# EAGLE design 7880_IO (EAGLE 7.2.0)
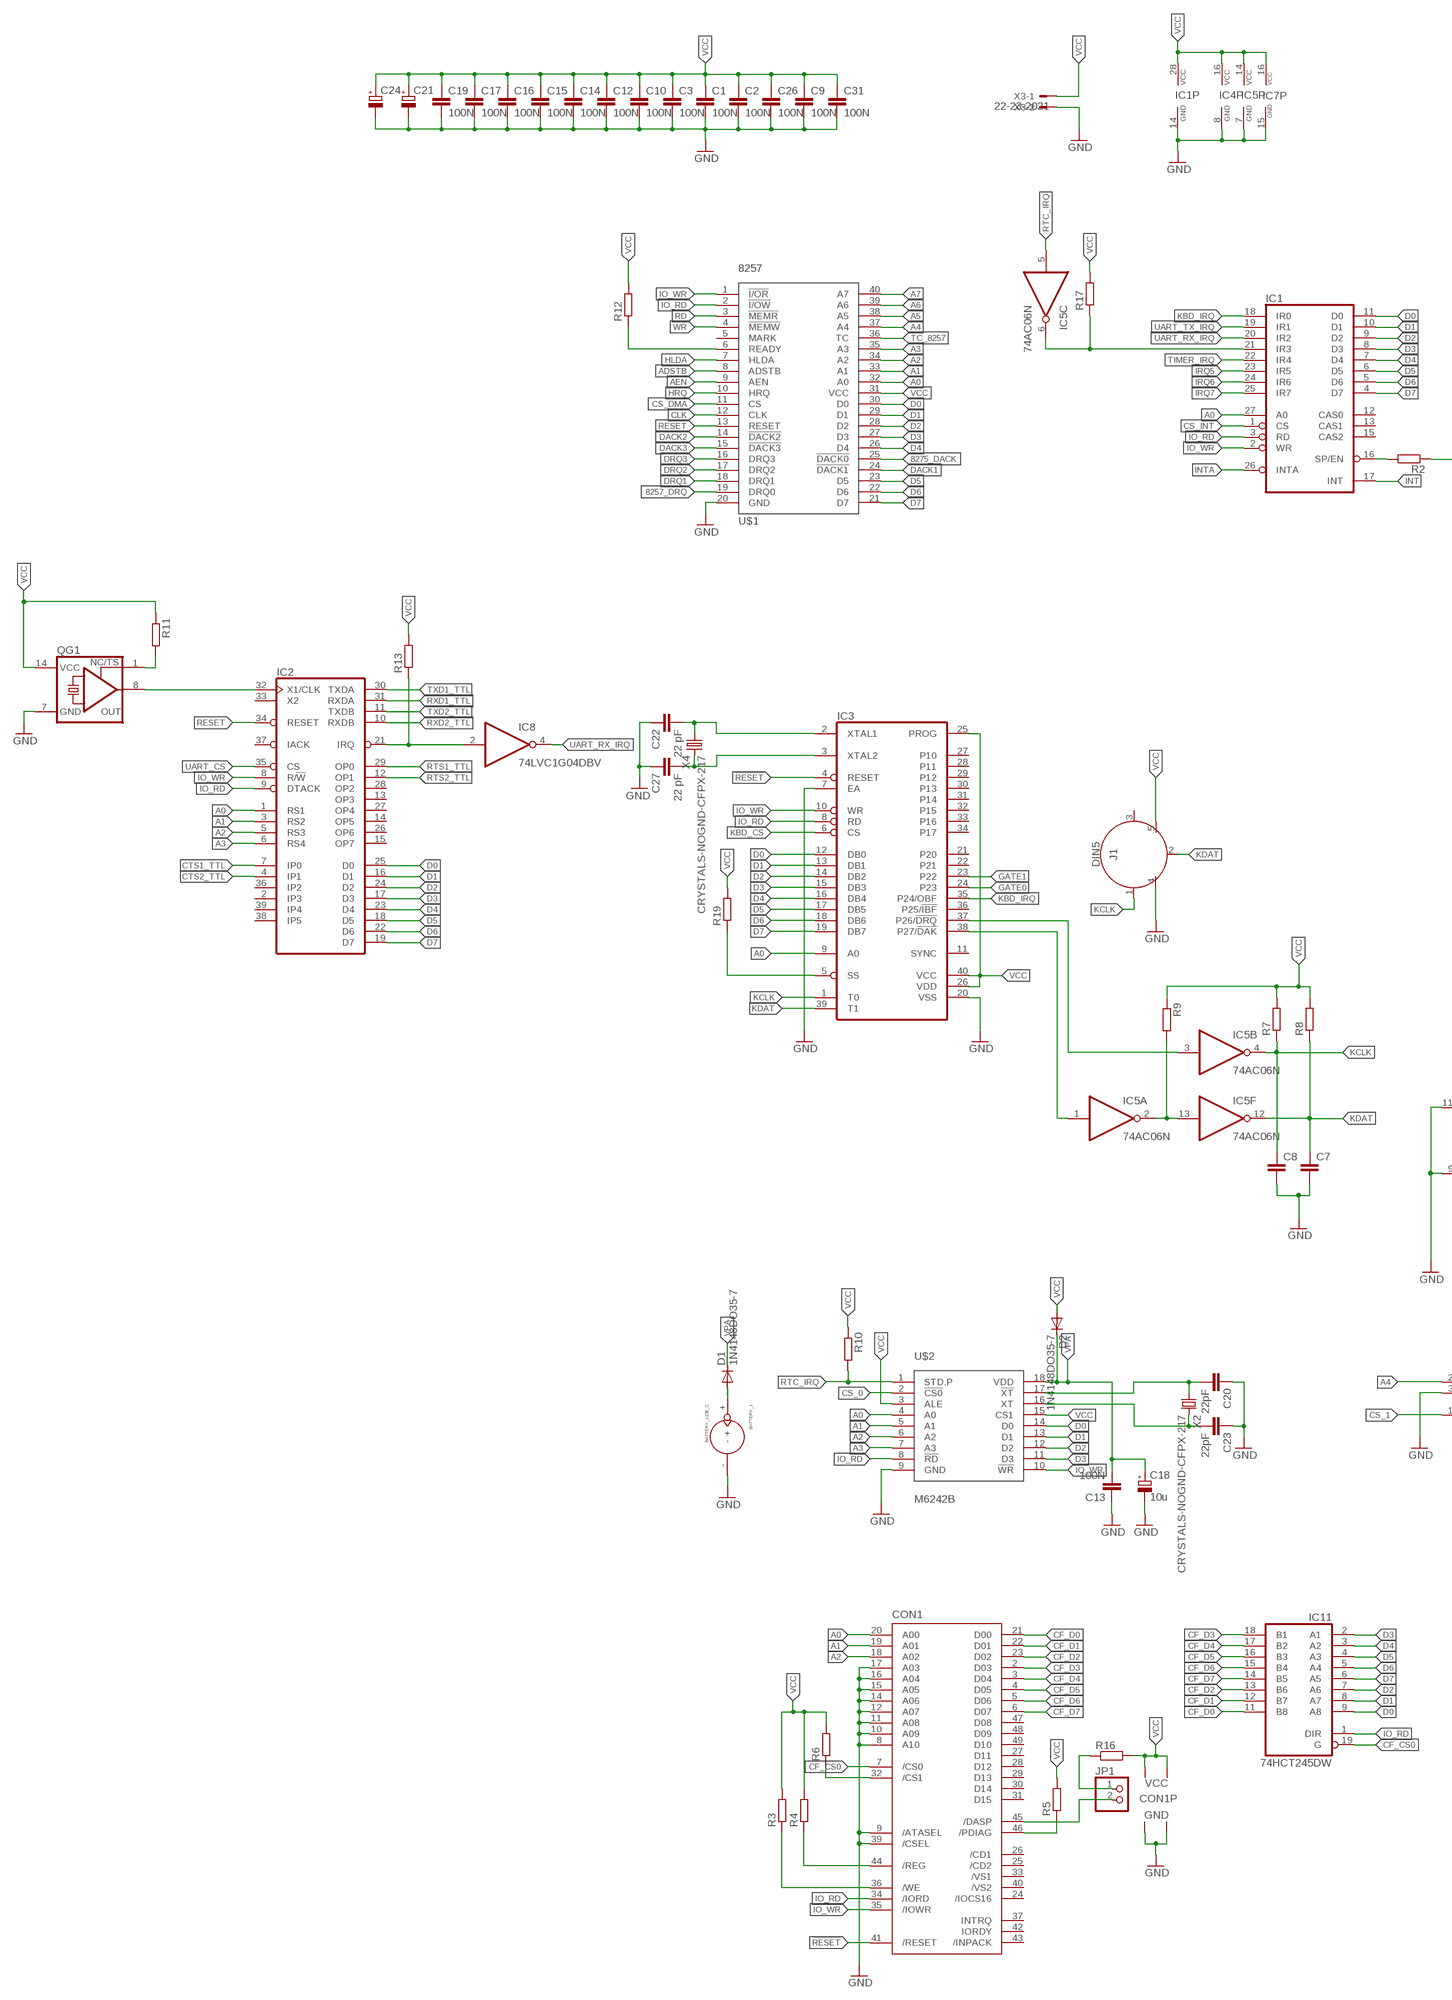
[diagram p0: schematic, sheet 1, part 1 of 2]
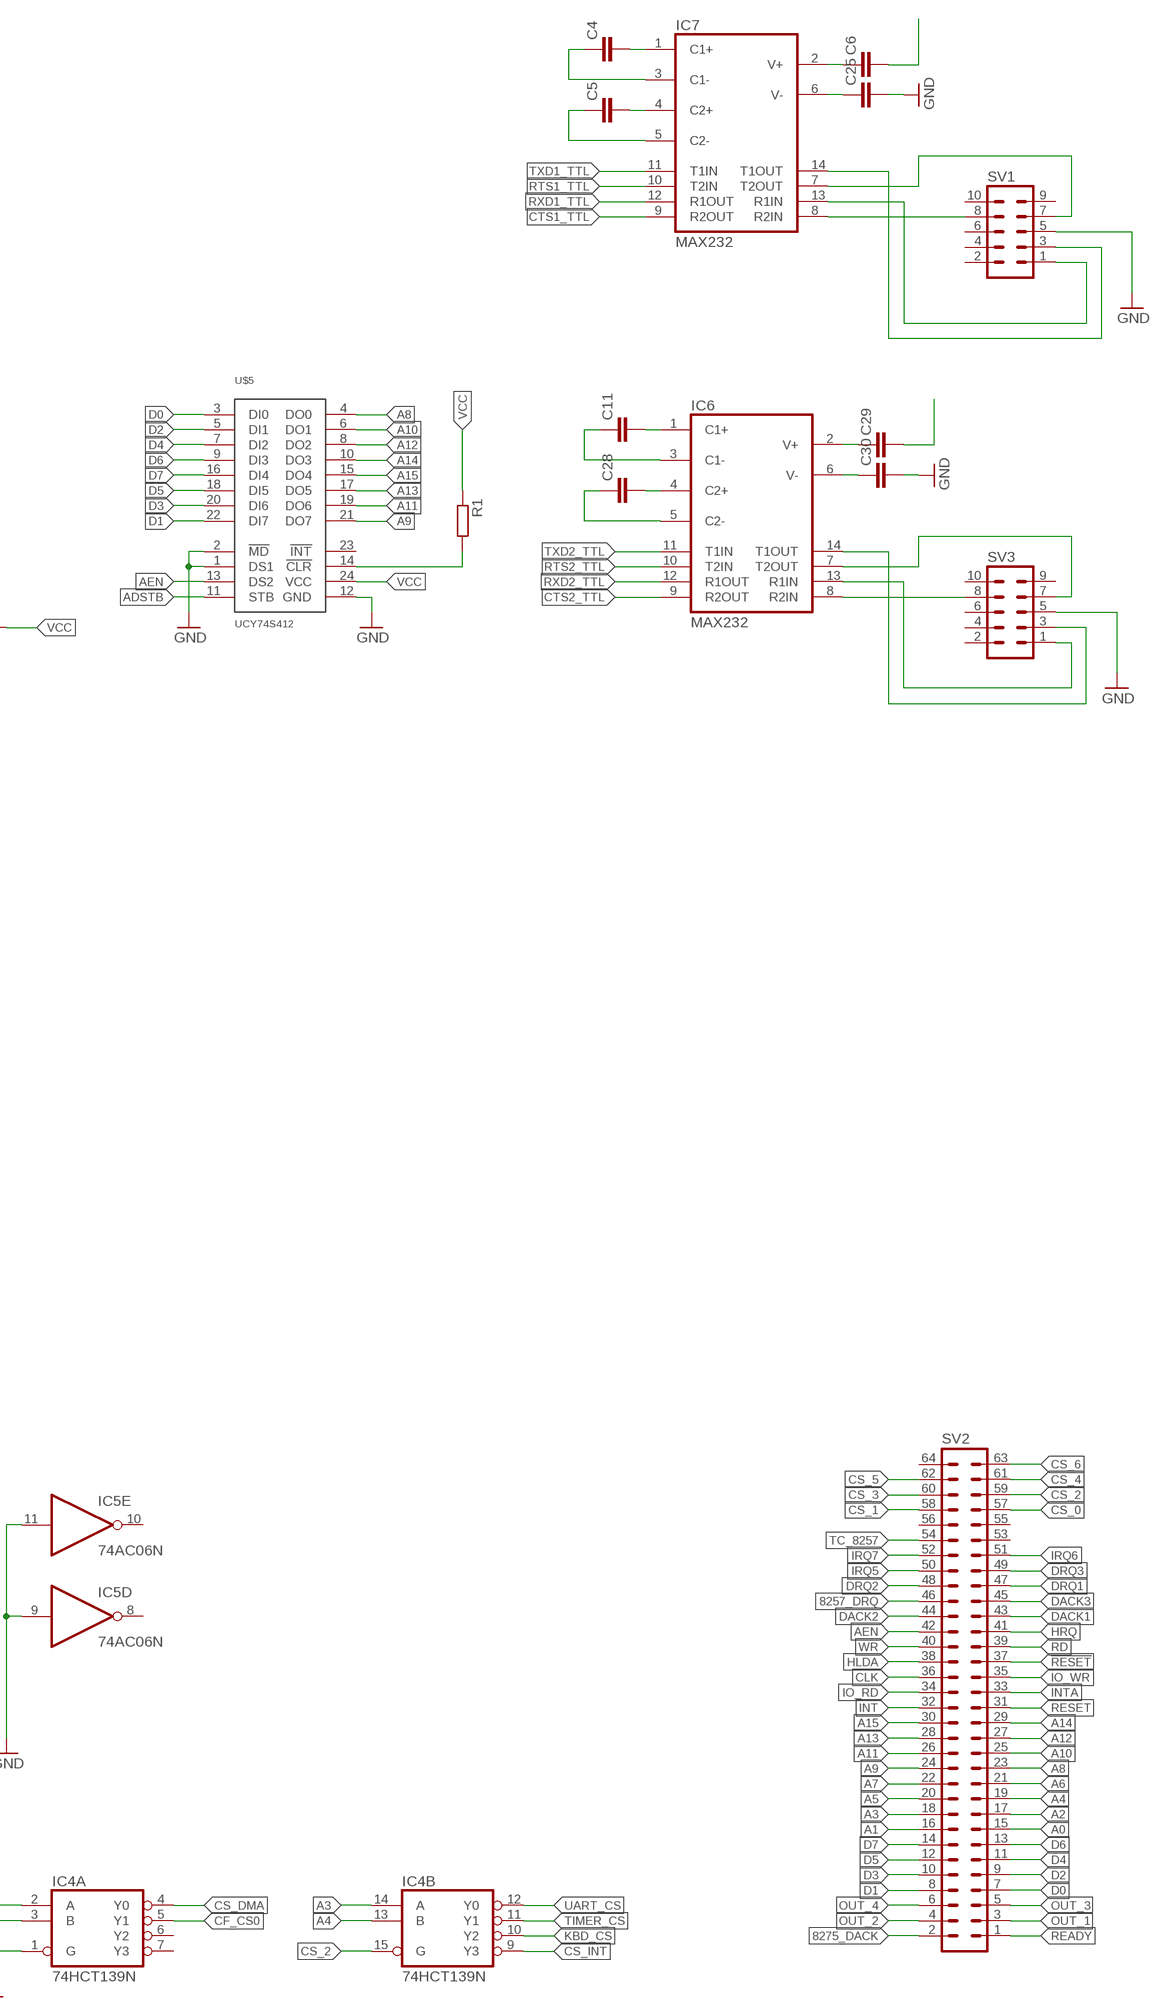
[diagram p1: schematic, sheet 1, part 2 of 2]

## Parts
BATTERY_1  BATTERY_1236_C  [BATTERY_1236_C]
C1  100N  C-EUC0603  [C0603]
C2  100N  C-EUC0603  [C0603]
C3  100N  C-EUC0603  [C0603]
C4  C-EUC0603  [C0603]
C5  C-EUC0603  [C0603]
C6  C-EUC0603  [C0603]
C7  C-EUC0603  [C0603]
C8  C-EUC0603  [C0603]
C9  100N  C-EUC0603  [C0603]
C10  100N  C-EUC0603  [C0603]
C11  C-EUC0603  [C0603]
C12  100N  C-EUC0603  [C0603]
C13  100N  C-EUC0603  [C0603]
C14  100N  C-EUC0603  [C0603]
C15  100N  C-EUC0603  [C0603]
C16  100N  C-EUC0603  [C0603]
C17  100N  C-EUC0603  [C0603]
C18  10u  CPOL-EUSMCB  [SMC_B]
C19  100N  C-EUC0603  [C0603]
C20  22pF  C-EUC0603  [C0603]
C21  CPOL-EUE3.5-8  [E3,5-8]
C22  22 pF  C-EUC0603  [C0603]
C23  22pF  C-EUC0603  [C0603]
C24  CPOL-EUSMCB  [SMC_B]
C25  C-EUC0603  [C0603]
C26  100N  C-EUC0603  [C0603]
C27  22 pF  C-EUC0603  [C0603]
C28  C-EUC0603  [C0603]
C29  C-EUC0603  [C0603]
C30  C-EUC0603  [C0603]
C31  100N  C-EUC0603  [C0603]
CON1  CF-CARD-IDE_MODE  [MI20-50PD-SF]
D1  1N4148DO35-7  [DO35-7]
D2  1N4148DO35-7  [DO35-7]
IC1  8259A  [DIL28-6]
IC2  MC68681P  [DIL40]
IC3  UPI-8042AH  [DIL40]
IC4  74HCT139N  [DIL16]
IC5  74AC06N  [DIL14]
IC6  MAX232  [DIL16]
IC7  MAX232  [DIL16]
IC8  74LVC1G04DBV  [SOT23-5]
IC11  74HCT245DW  [SO20W]
J1  DIN5  [DIN5-RA-PTH]
JP1  PINHD-1X2  [1X02]
QG1  XO-14  [DIL14S]
R1  R-EU_R0603  [R0603]
R2  R-EU_R0603  [R0603]
R3  R-EU_R0603  [R0603]
R4  R-EU_0204/7  [0204/7]
R5  R-EU_0207/10  [0207/10]
R6  R-EU_R0603  [R0603]
R7  R-EU_0204/5  [0204/5]
R8  R-EU_M0805  [M0805]
R9  R-EU_R0603  [R0603]
R10  R-EU_R0603  [R0603]
R11  R-EU_R0603  [R0603]
R12  R-EU_R0603  [R0603]
R13  R-EU_0204/7  [0204/7]
R16  R-EU_R0603  [R0603]
R17  R-EU_0204/7  [0204/7]
R19  R-EU_0204/5  [0204/5]
SV1  ML10  [ML10]
SV2  ML64L  [ML64L]
SV3  ML10  [ML10]
U$1  8257  [DIL40]
U$2  M6242B  [DIL18]
U$5  UCY74S412  [DIL24-6]
X2  CRYSTALS-NOGND-CFPX-217  [3.2X1.5-2-PAD]
X3  22-23-2021  [22-23-2021]
X4  CRYSTALS-NOGND-CFPX-217  [3.2X1.5-2-PAD]

## Nets
8257_DRQ: SV2.46 U$1.19(DRQ0)
8275_DACK: SV2.2 U$1.25(!DACK0)
2457600HZ: IC2.32(X1/CLK) QG1.8(OUT)
!RESET: CON1.41(/RESET) IC3.4(RESET) SV2.37
A0: CON1.20(A00) IC1.27(A0) IC2.1(RS1) IC3.9(A0) SV2.15 U$1.32(A0) U$2.4(A0)
A1: CON1.19(A01) IC2.3(RS2) SV2.16 U$1.33(A1) U$2.5(A1)
A2: CON1.18(A02) IC2.5(RS3) SV2.17 U$1.34(A2) U$2.6(A2)
A3: IC2.6(RS4) IC4.14(B:A) SV2.18 U$1.35(A3) U$2.7(A3)
A4: IC4.2(A:A) IC4.13(B:B) SV2.19 U$1.37(A4)
A5: SV2.20 U$1.38(A5)
A6: SV2.21 U$1.39(A6)
A7: SV2.22 U$1.40(A7)
A8: SV2.23 U$5.4(DO0)
A9: SV2.24 U$5.21(DO7)
A10: SV2.25 U$5.6(DO1)
A11: SV2.26 U$5.19(DO6)
A12: SV2.27 U$5.8(DO2)
A13: SV2.28 U$5.17(DO5)
A14: SV2.29 U$5.10(DO3)
A15: SV2.30 U$5.15(DO4)
ADSTB: U$1.8(ADSTB) U$5.11(STB)
AEN: SV2.42 U$1.9(AEN) U$5.13(DS2)
CF_CS0: CON1.7(/CS0) IC4.5(A:Y1) IC11.19(G)
CF_D0: CON1.21(D00) IC11.11(B8)
CF_D1: CON1.22(D01) IC11.12(B7)
CF_D2: CON1.23(D02) IC11.13(B6)
CF_D3: CON1.2(D03) IC11.18(B1)
CF_D4: CON1.3(D04) IC11.17(B2)
CF_D5: CON1.4(D05) IC11.16(B3)
CF_D6: CON1.5(D06) IC11.15(B4)
CF_D7: CON1.6(D07) IC11.14(B5)
CLK: SV2.36 U$1.12(CLK)
COM1_CTS: IC7.8(R2IN) SV1.8
COM1_RXD: IC7.13(R1IN) SV1.1
COM1_TXD: IC7.14(T1OUT) SV1.3
CS_0: SV2.57 U$2.2(!CS0)
CS_1: IC4.1(A:G) SV2.58
CS_2: IC4.15(B:G) SV2.59
CS_3: SV2.60
CS_4: SV2.61
CS_5: SV2.62
CS_6: SV2.63
CS_DMA: IC4.4(A:Y0) U$1.11(CS)
CS_INT: IC1.1(CS) IC4.9(B:Y3)
CTS1_TTL: IC2.7(IP0) IC7.9(R2OUT)
CTS2_TTL: IC2.4(IP1) IC6.9(R2OUT)
D0: IC1.11(D0) IC2.25(D0) IC3.12(DB0) IC11.9(A8) SV2.7 U$1.30(D0) U$2.14(D0) U$5.3(DI0)
D1: IC1.10(D1) IC2.16(D1) IC3.13(DB1) IC11.8(A7) SV2.8 U$1.29(D1) U$2.13(D1) U$5.22(DI7)
D2: IC1.9(D2) IC2.24(D2) IC3.14(DB2) IC11.7(A6) SV2.9 U$1.28(D2) U$2.12(D2) U$5.5(DI1)
D3: IC1.8(D3) IC2.17(D3) IC3.15(DB3) IC11.2(A1) SV2.10 U$1.27(D3) U$2.11(D3) U$5.20(DI6)
D4: IC1.7(D4) IC2.23(D4) IC3.16(DB4) IC11.3(A2) SV2.11 U$1.26(D4) U$5.7(DI2)
D5: IC1.6(D5) IC2.18(D5) IC3.17(DB5) IC11.4(A3) SV2.12 U$1.23(D5) U$5.18(DI5)
D6: IC1.5(D6) IC2.22(D6) IC3.18(DB6) IC11.5(A4) SV2.13 U$1.22(D6) U$5.9(DI3)
D7: IC1.4(D7) IC2.19(D7) IC3.19(DB7) IC11.6(A5) SV2.14 U$1.21(D7) U$5.16(DI4)
DACK1: SV2.43 U$1.24(!DACK1)
DACK2: SV2.44 U$1.14(!DACK2)
DACK3: SV2.45 U$1.15(!DACK3)
DRQ1: SV2.47 U$1.18(DRQ1)
DRQ2: SV2.48 U$1.17(DRQ2)
DRQ3: SV2.49 U$1.16(DRQ3)
GATE0: IC3.24(P23)
GATE1: IC3.23(P22)
GND: BATTERY_1.- C1.2 C2.2 C3.2 C7.2 C8.2 C9.2 C10.2 C12.2 C13.1 C14.2 C15.2 C16.2 C17.2 C18.- C19.2 C20.1 C21.- C22.1 C23.1 C24.- C25.2 C26.2 C27.1 C30.2 C31.2 CON1.1(GND1) CON1.8(A10) CON1.9(/ATASEL) CON1.10(A09) CON1.11(A08) CON1.12(A07) CON1.14(A06) CON1.15(A05) CON1.16(A04) CON1.17(A03) CON1.39(/CSEL) CON1.50(GND2) IC1.14(GND) IC3.7(EA) IC3.20(VSS) IC4.3(A:B) IC4.8(P:GND) IC5.7(P:GND) IC5.9(D:I) IC5.11(E:I) IC7.15(GND) J1.4 QG1.7(GND) SV1.5 SV3.5 U$1.20(GND) U$2.9(GND) U$5.1(DS1) U$5.2(!MD) U$5.12(GND) X3.2
HLDA: SV2.38 U$1.7(HLDA)
HRQ: SV2.41 U$1.10(HRQ)
INT: IC1.17(INT) SV2.32
INTA: IC1.26(INTA) SV2.33
IO_RD: CON1.34(/IORD) IC1.3(RD) IC2.9(DTACK) IC3.8(RD) IC11.1(DIR) SV2.34 U$1.2(!I/OW) U$2.8(!RD)
IO_WR: CON1.35(/IOWR) IC1.2(WR) IC2.8(R/!W) IC3.10(WR) SV2.35 U$1.1(!I/OR) U$2.10(!WR)
IRQ5: IC1.23(IR5) SV2.50
IRQ6: IC1.24(IR6) SV2.51
IRQ7: IC1.25(IR7) SV2.52
KBD_CS: IC3.6(CS) IC4.10(B:Y2)
KBD_IRQ: IC1.18(IR0) IC3.35(P24/OBF)
KCLK: C8.1 IC3.1(T0) IC5.4(B:O) J1.1 R7.1
KDAT: C7.1 IC3.39(T1) IC5.12(F:O) J1.2 R8.1
N$1: R1.2 U$5.14(!CLR)
N$2: IC1.16(SP/EN) R2.2
N$3: IC3.38(P27/!DAK) IC5.1(A:I)
N$4: CON1.36(/WE) R3.1
N$5: R12.1 U$1.6(READY)
N$6: QG1.1(TS) R11.2
N$8: IC2.21(IRQ) IC8.2(I) R13.1
N$9: C4.2 IC7.1(C1+)
N$10: C5.2 IC7.4(C2+)
N$11: C5.1 IC7.5(C2-)
N$12: C4.1 IC7.3(C1-)
N$13: C6.1 IC7.2(V+)
N$14: C25.1 IC7.6(V-)
N$15: IC6.7(T2OUT) SV3.7
N$16: C11.2 IC6.1(C1+)
N$17: IC3.37(P26/!DRQ) IC5.3(B:I)
N$18: IC7.7(T2OUT) SV1.7
N$19: CON1.44(/REG) R4.1
N$20: IC5.2(A:O) IC5.13(F:I) R9.2
N$21: CON1.46(/PDIAG) R5.1
N$22: BATTERY_1.+ D1.A
N$26: C28.2 IC6.4(C2+)
N$27: C28.1 IC6.5(C2-)
N$29: CON1.32(/CS1) R6.1
N$30: C11.1 IC6.3(C1-)
N$31: C29.1 IC6.2(V+)
N$32: IC1.21(IR3) IC5.6(C:O) R17.1
N$33: CON1.45(/DASP) JP1.2
N$34: JP1.1 R16.1
N$35: IC3.5(SS) R19.1
N$36: IC6.13(R1IN) SV3.1
N$38: IC6.14(T1OUT) SV3.3
N$39: IC6.8(R2IN) SV3.8
N$40: C30.1 IC6.6(V-)
OUT_1: SV2.3
OUT_2: SV2.4
OUT_3: SV2.5
OUT_4: SV2.6
RD: SV2.39 U$1.3(!MEMR)
READY: SV2.1
RESET: IC2.34(RESET) SV2.31 U$1.13(RESET)
RTC_IRQ: IC5.5(C:I) R10.2 U$2.1(STD.P)
RTS1_TTL: IC2.29(OP0) IC7.10(T2IN)
RTS2_TTL: IC2.12(OP1) IC6.10(T2IN)
RXD1_TTL: IC2.31(RXDA) IC7.12(R1OUT)
RXD2_TTL: IC2.10(RXDB) IC6.12(R1OUT)
SOSCI: C20.2 U$2.17(!XT) X2.1
SOSCO: C23.2 U$2.16(XT) X2.2
TC_8257: SV2.54 U$1.36(TC)
TIMER_CS: IC4.11(B:Y1)
TIMER_IRQ: IC1.22(IR4)
TXD1_TTL: IC2.30(TXDA) IC7.11(T1IN)
TXD2_TTL: IC2.11(TXDB) IC6.11(T1IN)
UART_CS: IC2.35(CS) IC4.12(B:Y0)
UART_RX_IRQ: IC1.20(IR2) IC8.4(O)
UART_TX_IRQ: IC1.19(IR1)
VCC: C1.1 C2.1 C3.1 C6.2 C9.1 C10.1 C12.1 C14.1 C15.1 C16.1 C17.1 C19.1 C21.+ C24.+ C26.1 C29.2 C31.1 CON1.13(VCC2) CON1.38(VCC1) D2.A IC1.28(VCC) IC3.25(PROG) IC3.26(VDD) IC3.40(VCC) IC4.16(P:VCC) IC5.14(P:VCC) IC7.16(VCC) J1.5 QG1.14(VCC) R1.1 R2.1 R3.2 R4.2 R5.2 R6.2 R7.2 R8.2 R9.1 R10.1 R11.1 R12.2 R13.2 R16.2 R17.2 R19.2 U$1.31(VCC) U$2.3(ALE) U$2.15(CS1) U$5.24(VCC) X3.1
VPA: C13.2 C18.+ D1.C D2.C U$2.18(VDD)
WR: SV2.40 U$1.4(!MEMW)
XTAL1: C22.2 IC3.2(XTAL1) X4.1
XTAL2: C27.2 IC3.3(XTAL2) X4.2
Unconnected: CON1.24(/IOCS16) CON1.25(/CD2) CON1.26(/CD1) CON1.27(D11) CON1.28(D12) CON1.29(D13) CON1.30(D14) CON1.31(D15) CON1.33(/VS1) CON1.37(INTRQ) CON1.40(/VS2) CON1.42(IORDY) CON1.43(/INPACK) CON1.47(D08) CON1.48(D09) CON1.49(D10) IC1.12(CAS0) IC1.13(CAS1) IC1.15(CAS2) IC2.2(IP3) IC2.13(OP3) IC2.14(OP5) IC2.15(OP7) IC2.26(OP6) IC2.27(OP4) IC2.28(OP2) IC2.33(X2) IC2.36(IP2) IC2.37(IACK) IC2.38(IP5) IC2.39(IP4) IC3.11(SYNC) IC3.21(P20) IC3.22(P21) IC3.27(P10) IC3.28(P11) IC3.29(P12) IC3.30(P13) IC3.31(P14) IC3.32(P15) IC3.33(P16) IC3.34(P17) IC3.36(P25/!IBF) IC4.6(A:Y2) IC4.7(A:Y3) IC5.8(D:O) IC5.10(E:O) J1.3 SV1.2 SV1.4 SV1.6 SV1.9 SV1.10 SV2.53 SV2.55 SV2.56 SV2.64 SV3.2 SV3.4 SV3.6 SV3.9 SV3.10 U$1.5(MARK) U$5.23(!INT)

## Power pins joined to a net without a drawn wire
GND: IC2.20(GND) IC6.15(GND) IC8.3(GND) IC11.10(GND)
VCC: IC2.40(VCC) IC6.16(VCC) IC8.5(VCC) IC11.20(VCC)

## Library data of the parts
BATTERY_1 = Itead_BP_110825.lbr:BATTERY_1236_C: SOC004
C1-C17 C19 C20 C22 C23 C25-C31 = rcl:C-EU: CAPACITOR, European symbol
C18 C21 C24 = rcl:CPOL-EU: POLARIZED CAPACITOR, European symbol
CON1 = con-hirose:CF-CARD-IDE_MODE: Compact Flash Adapter Type I or II without Eject Button Source: con-hirose.lbr from Bob Starr <rtzaudio@mindspring.com>; OC_FARNELL: unknown; OC_NEWARK: unknown
D1 D2 = diode:1N4148: DIODE high speed (Philips)
IC1 = micro-intel:8259A: MICROCOMPUTER/PERIPHERAL DEVICE; OC_FARNELL: unknown; OC_NEWARK: unknown
IC2 = micro-mc68000:MC68681P: 68xxx PROCESSOR; OC_FARNELL: unknown; OC_NEWARK: unknown
IC3 = micro-intel:UPI-8042AH: MICROCOMPUTER/PERIPHERAL DEVICE; OC_FARNELL: unknown; OC_NEWARK: unknown
IC4 = 74xx-eu:74*139: Dual 2-line to 4-line DECODER/DEMULTIPLEXER
IC5 = 74xx-eu:74*06: Hex INVERTER, open collector high-voltage output
IC6 IC7 = maxim:MAX232: RS232 TRANSCEIVER; MF: MAXIM; MPN: MAX232ACPE+; OC_FARNELL: 9723773; OC_NEWARK: 68K4544
IC8 = 74xx-little-us:74*1G04: INVERTER Gate
IC11 = 74xx-eu:74*245: Octal BUS TRANSCEIVER, 3-state
J1 = SparkFun-Connectors:DIN5: DIN5 Connector - Female Right Angle (frequently used as a MIDI Jack connector) This type of connector and cable is frequently used for transmitting midi data (musical instrument digital interface). It is what you usually see on a keyboard or set of electronic drums. Learn more here <https://en.wikipedia.org/wiki/MIDI>. For more information on the pinout and electrical specifications of MIDI communications, please see the following resource: https://www.midi.org/specifications/item/midi-din-electrical-specification Here is the connector we sell at SparkFun: MIDI Connector - Female Right Angle <https://www.sparkfun.com/products/9536> (PRT-09536) Datasheet <hhttp://www.sparkfun.com/datasheets/Prototyping/Connectors/MIDI-RA.pdf> It is used on this SparkFun product: SparkFun MIDI Shield <https://www.sparkfun.com/products/12898> (DEV-12898); PROD_ID: CONN-09481
JP1 = pinhead:PINHD-1X2: PIN HEADER
QG1 = crystal:XO-: CRYSTAL; OC_FARNELL: unknown; OC_NEWARK: unknown
R1-R13 R16 R17 R19 = rcl:R-EU_: RESISTOR, European symbol
SV1 SV3 = con-ml:ML10: HARTING; OC_FARNELL: unknown; OC_NEWARK: unknown
SV2 = con-harting-ml:ML64: HARTING; OC_FARNELL: unknown; OC_NEWARK: unknown
U$1 = mw:8257
U$2 = mw:M6242B
U$5 = mw:UCY74S412
X2 X4 = IQD-Frequency-Products:CRYSTALS-NOGND: CRYSTALS CAN NOT GROUNDED
X3 = con-molex:22-23-2021: .100" (2.54mm) Center Header - 2 Pin; MF: MOLEX; MPN: 22-23-2021; OC_FARNELL: 1462926; OC_NEWARK: 25C3832

## Board
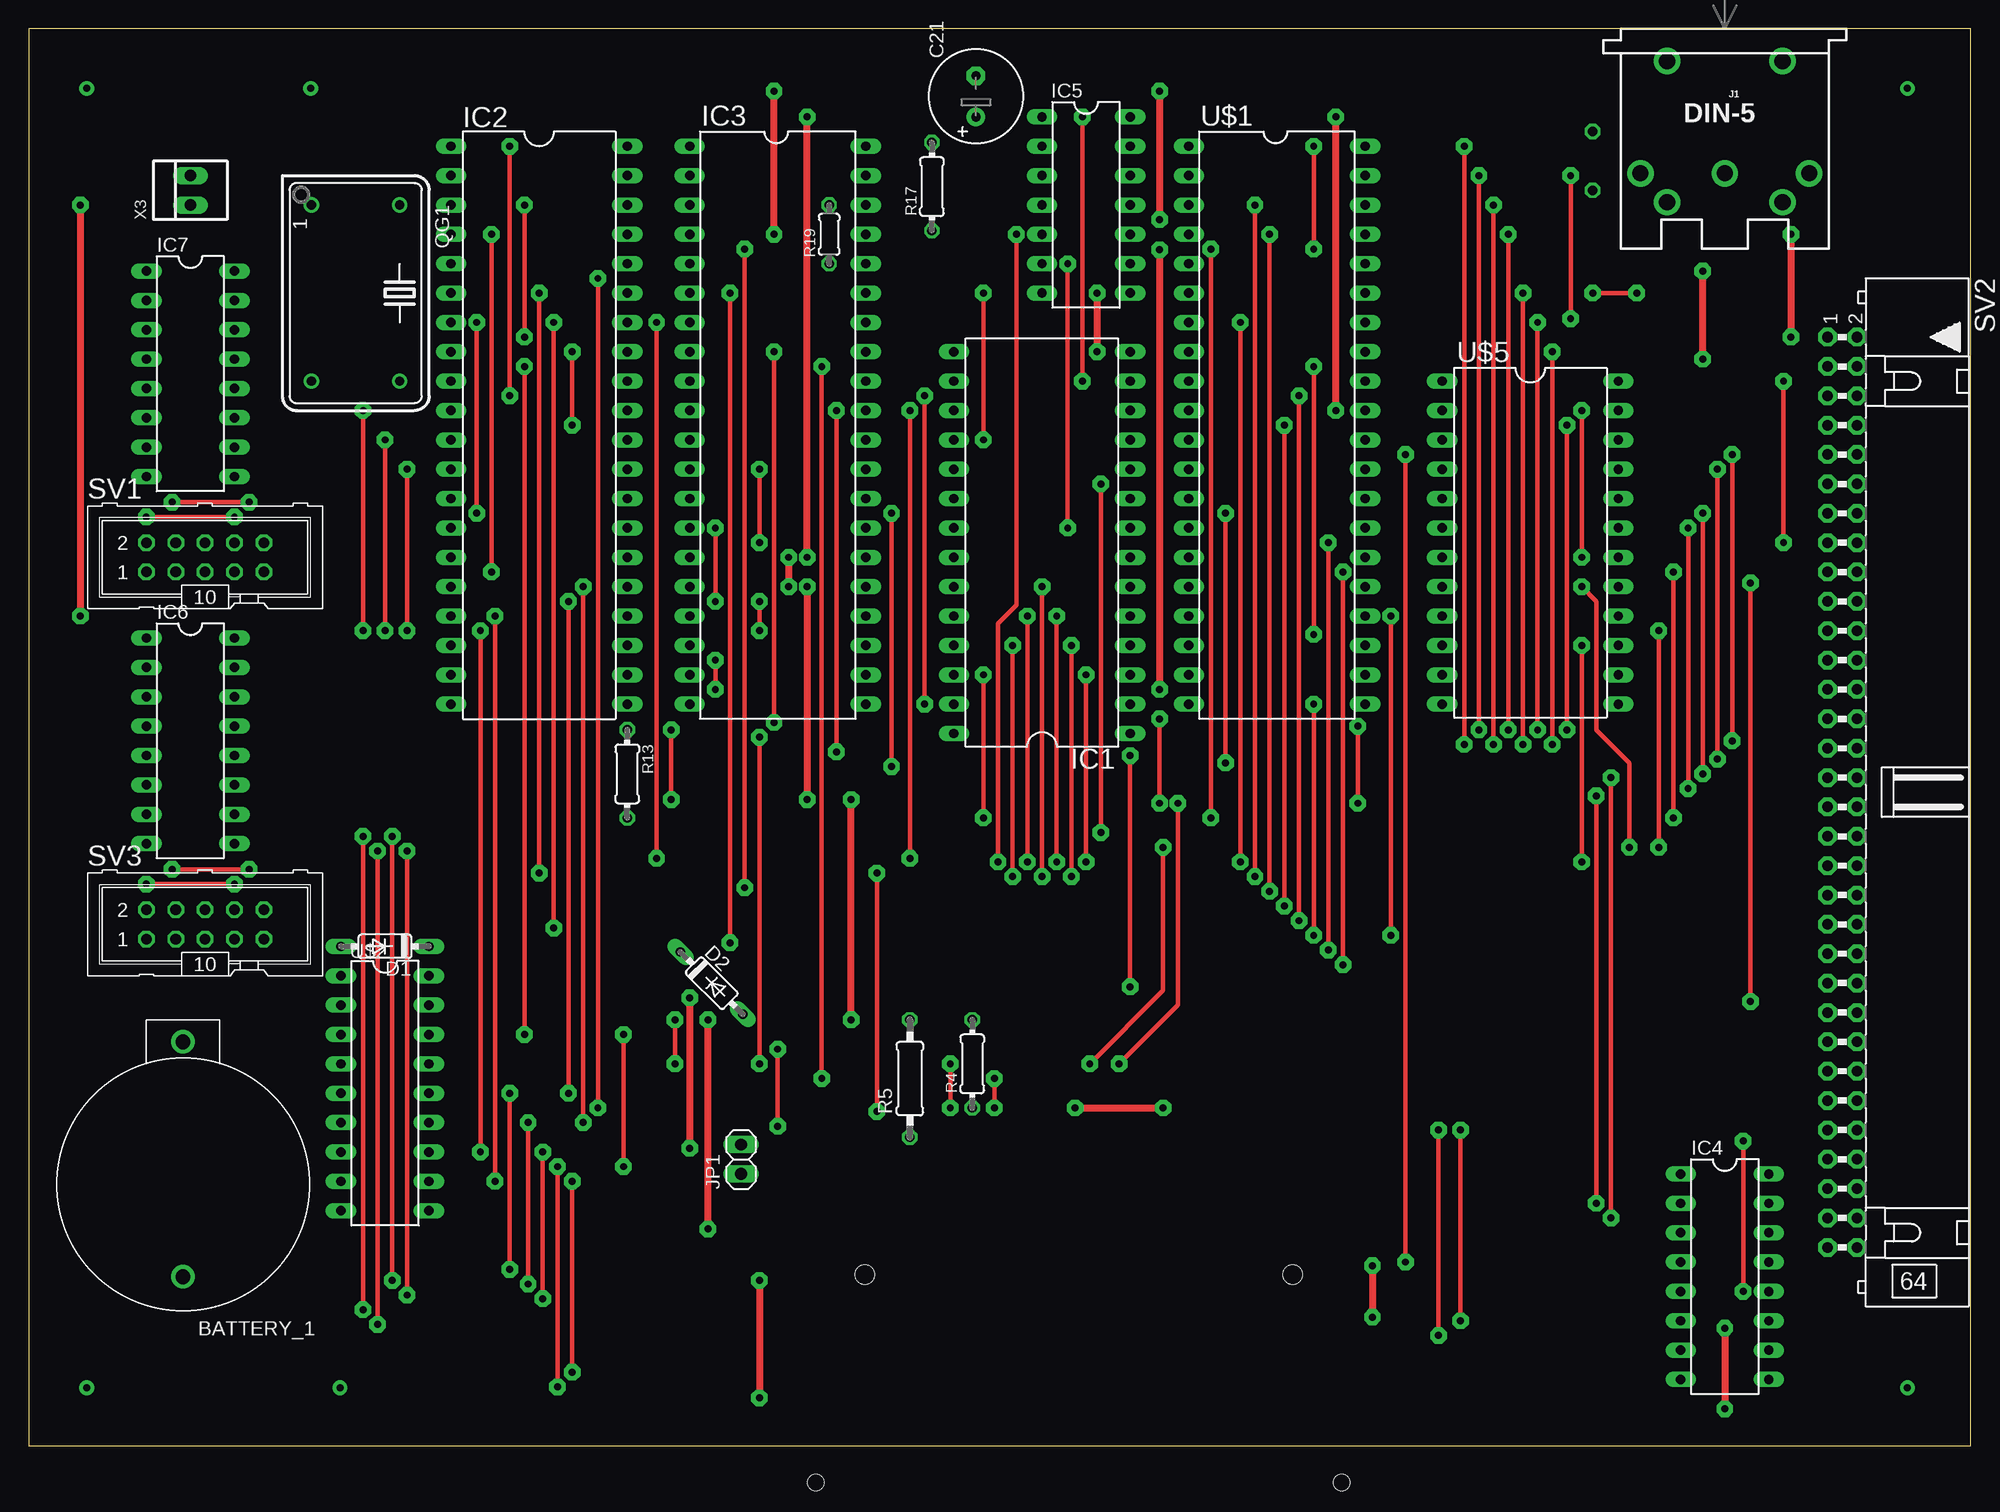
[diagram p2: board, top side]
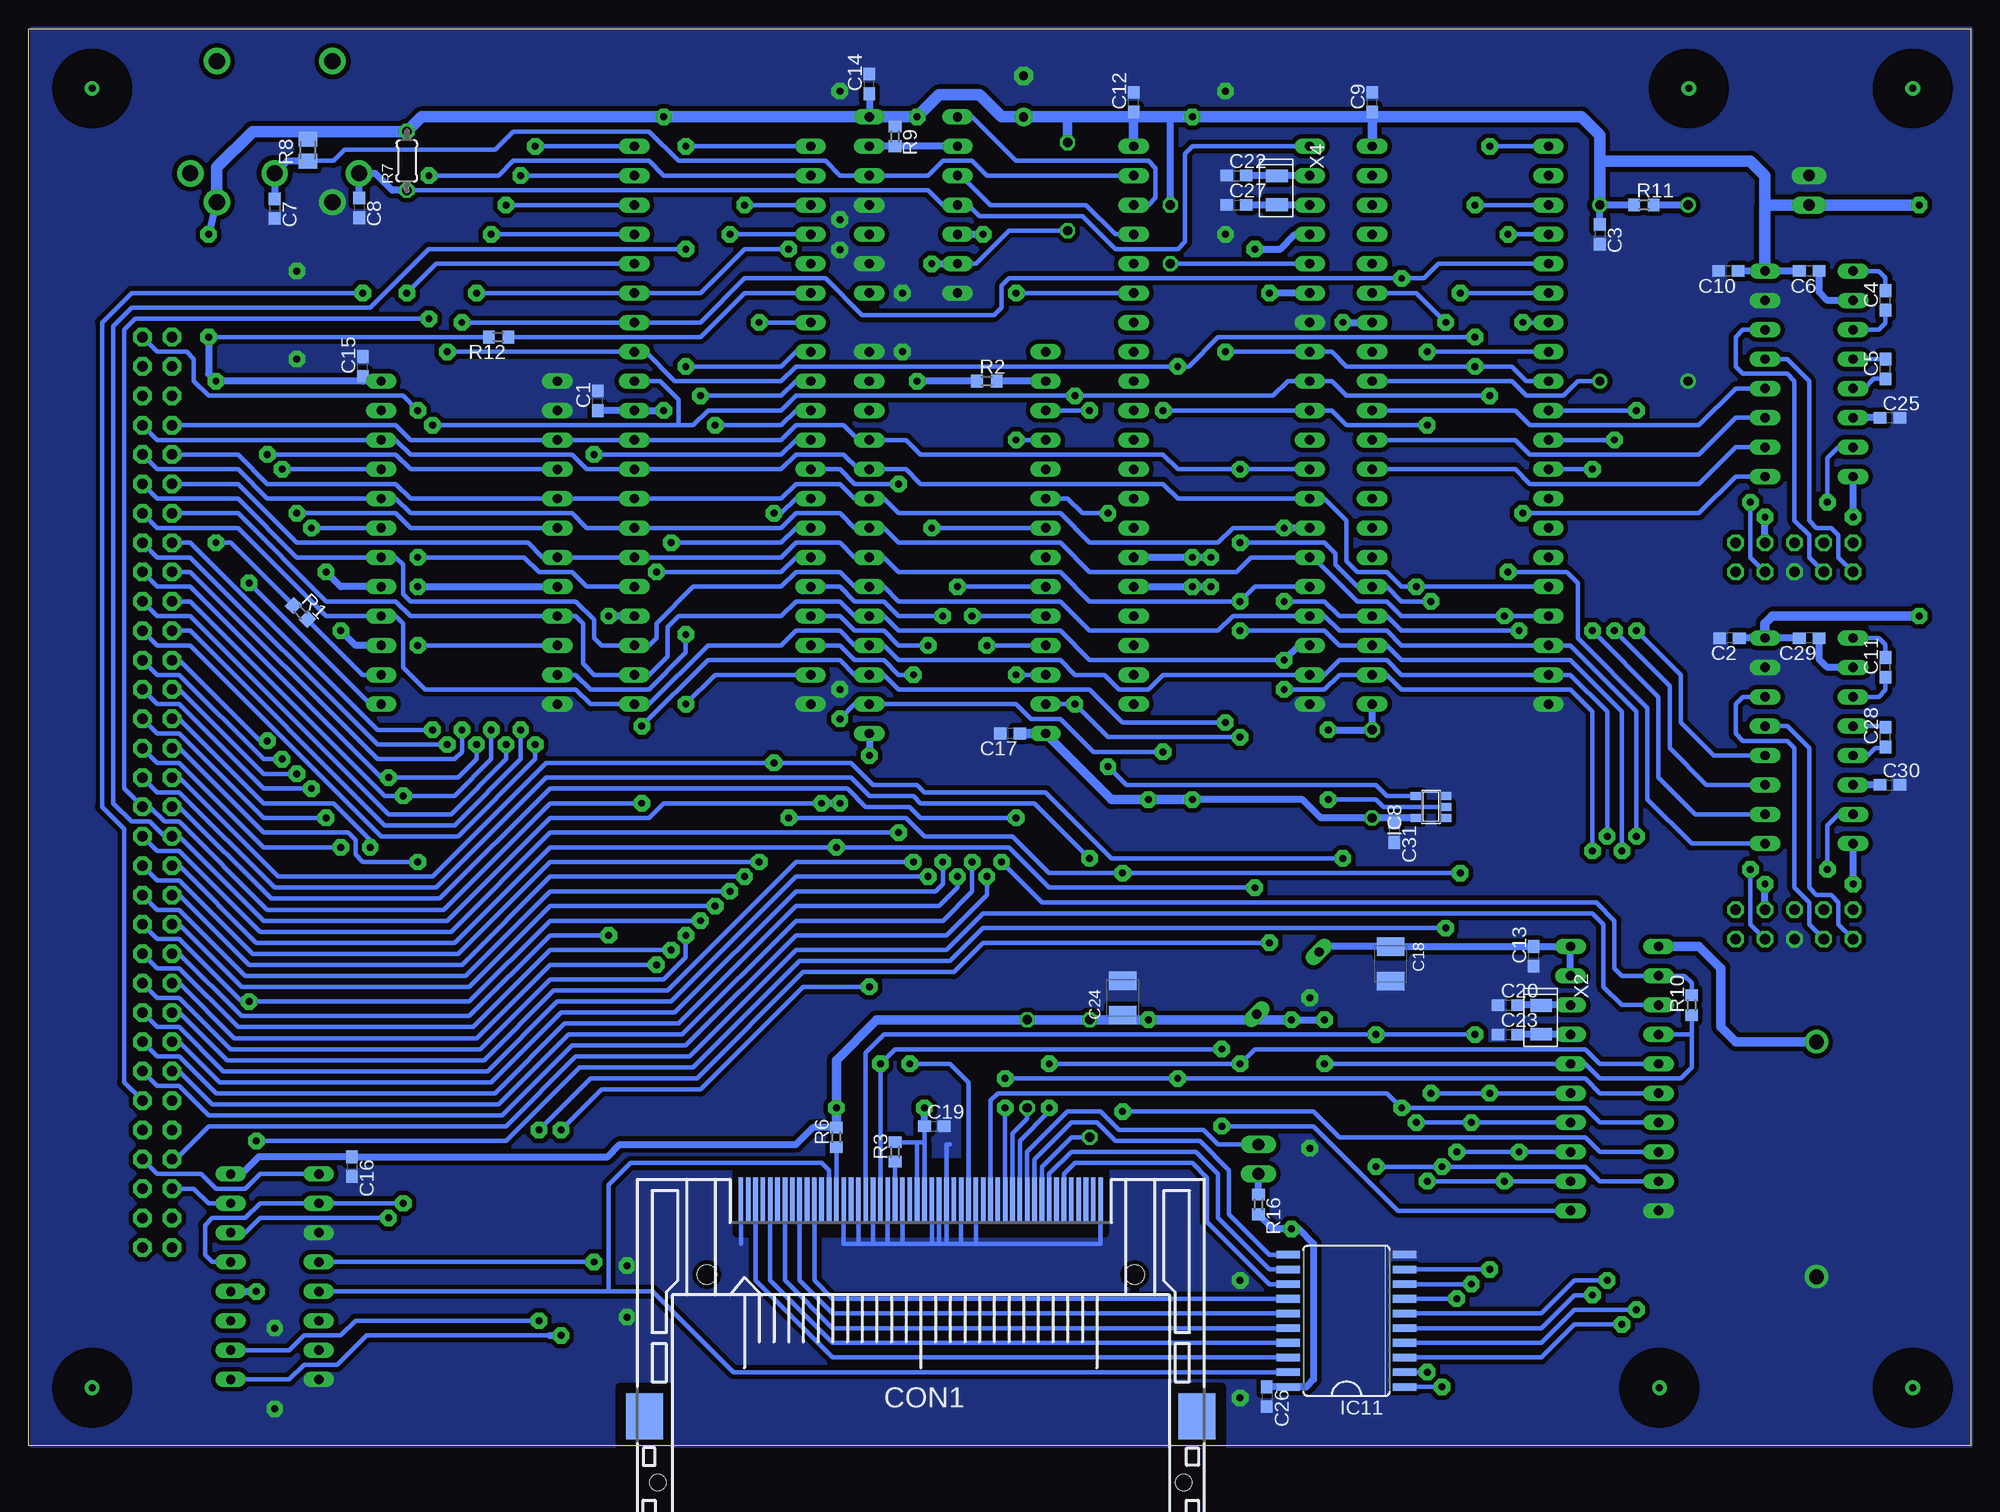
[diagram p3: board, bottom side, seen from below]

Size 167.94 x 122.55 mm. Coordinates in mm from the lower left corner, seen from the top.
Outline: 0,0 167.94,0 167.94,122.55 0,122.55 0,0
Copper layers (1*16): Top 0.035mm / dielectric 1.5mm / Bottom 0.035mm
Design rules "default *": minimum track width 10mil, minimum drill 24mil, track to track 8mil, track to pad 8mil, pad to pad 8mil, via to via 8mil, smd to smd 8mil, copper to edge 0mil, drill to drill 8mil, minimum pad ring 10mil, minimum via ring 8mil, stop-mask expansion 4mil, vias tented up to drill 0mil, thermal gap 10mil
bRestrict: area 23.9,2 to 30,8; area 21.3,114.3 to 27.4,120.4; area 159.4,2 to 165.5,8; area 159.4,114.3 to 165.5,120.4; area 74.9,18.4 to 106.7,24.4; area 2,2 to 8,8; area 2,114.3 to 8,120.4

### Footprints (pad centres in the part's own frame; a part is rotated, then mirrored left to right if it is on the bottom)
BATTERY_1236_C = drill 1.27 pad 2.032: + 0,0; - 0,20.32
C0603 = smd 1.1 x 1: 1 -0.85,0; 2 0.85,0
SMC_B = smd 1.6 x 2.4: + -1.5,0; - 1.5,0
E3,5-8 = drill 0.813 pad 1.6: + -1.778,0 | drill 0.813 pad 1.6 octagon: - 1.778,0
MI20-50PD-SF = smd 0.41 x 3.75: 1 15.557,-18.78; 2 14.287,-18.78; 3 13.018,-18.78; 4 11.748,-18.78; 5 10.477,-18.78; 6 9.207,-18.78; 7 7.938,-18.78; 8 6.668,-18.78; 9 5.397,-18.78; 10 4.128,-18.78; 11 2.857,-18.78; 12 1.587,-18.78; 13 0.318,-18.78; 14 -0.953,-18.78; 15 -2.223,-18.78; 16 -3.493,-18.78; 17 -4.763,-18.78; 18 -6.032,-18.78; 19 -7.303,-18.78; 20 -8.572,-18.78; 21 -9.842,-18.78; 22 -11.113,-18.78; 23 -12.383,-18.78; 24 -13.652,-18.78; 25 -14.922,-18.78; 26 14.922,-18.78; 27 13.652,-18.78; 28 12.383,-18.78; 29 11.113,-18.78; 30 9.842,-18.78; 31 8.572,-18.78; 32 7.303,-18.78; 33 6.032,-18.78; 34 4.763,-18.78; 35 3.493,-18.78; 36 2.223,-18.78; 37 0.953,-18.78; 38 -0.318,-18.78; 39 -1.587,-18.78; 40 -2.857,-18.78; 41 -4.128,-18.78; 42 -5.397,-18.78; 43 -6.668,-18.78; 44 -7.938,-18.78; 45 -9.207,-18.78; 46 -10.477,-18.78; 47 -11.748,-18.78; 48 -13.018,-18.78; 49 -14.287,-18.78; 50 -15.557,-18.78 | smd 3.2 x 4: M1 -23.883,-0.005; M2 23.883,-0.005 | hole 1.676: 18.5,-12.25; -18.5,-12.25 | hole 1.422: -22.75,5.75; 22.75,5.75
DO35-7 = drill 0.813 long: A 3.81,0; C -3.81,0
DIL28-6 = drill 0.813 long: 1 -16.51,-7.62; 2 -13.97,-7.62; 3 -11.43,-7.62; 4 -8.89,-7.62; 5 -6.35,-7.62; 6 -3.81,-7.62; 7 -1.27,-7.62; 8 1.27,-7.62; 9 3.81,-7.62; 10 6.35,-7.62; 11 8.89,-7.62; 12 11.43,-7.62; 13 13.97,-7.62; 14 16.51,-7.62; 15 16.51,7.62; 16 13.97,7.62; 17 11.43,7.62; 18 8.89,7.62; 19 6.35,7.62; 20 3.81,7.62; 21 1.27,7.62; 22 -1.27,7.62; 23 -3.81,7.62; 24 -6.35,7.62; 25 -8.89,7.62; 26 -11.43,7.62; 27 -13.97,7.62; 28 -16.51,7.62
DIL40 = drill 0.813 long: 1 -24.13,-7.62; 2 -21.59,-7.62; 3 -19.05,-7.62; 4 -16.51,-7.62; 5 -13.97,-7.62; 6 -11.43,-7.62; 7 -8.89,-7.62; 8 -6.35,-7.62; 9 -3.81,-7.62; 10 -1.27,-7.62; 11 1.27,-7.62; 12 3.81,-7.62; 13 6.35,-7.62; 14 8.89,-7.62; 15 11.43,-7.62; 16 13.97,-7.62; 17 16.51,-7.62; 18 19.05,-7.62; 19 21.59,-7.62; 20 24.13,-7.62; 21 24.13,7.62; 22 21.59,7.62; 23 19.05,7.62; 24 16.51,7.62; 25 13.97,7.62; 26 11.43,7.62; 27 8.89,7.62; 28 6.35,7.62; 29 3.81,7.62; 30 1.27,7.62; 31 -1.27,7.62; 32 -3.81,7.62; 33 -6.35,7.62; 34 -8.89,7.62; 35 -11.43,7.62; 36 -13.97,7.62; 37 -16.51,7.62; 38 -19.05,7.62; 39 -21.59,7.62; 40 -24.13,7.62
DIL16 = drill 0.813 long: 1 -8.89,-3.81; 2 -6.35,-3.81; 3 -3.81,-3.81; 4 -1.27,-3.81; 5 1.27,-3.81; 6 3.81,-3.81; 7 6.35,-3.81; 8 8.89,-3.81; 9 8.89,3.81; 10 6.35,3.81; 11 3.81,3.81; 12 1.27,3.81; 13 -1.27,3.81; 14 -3.81,3.81; 15 -6.35,3.81; 16 -8.89,3.81
DIL14 = drill 0.813 long: 1 -7.62,-3.81; 2 -5.08,-3.81; 3 -2.54,-3.81; 4 0,-3.81; 5 2.54,-3.81; 6 5.08,-3.81; 7 7.62,-3.81; 8 7.62,3.81; 9 5.08,3.81; 10 2.54,3.81; 11 0,3.81; 12 -2.54,3.81; 13 -5.08,3.81; 14 -7.62,3.81
SOT23-5 = smd 0.69 x 0.99: 1 -0.95,-1.29; 2 0,-1.29; 3 0.95,-1.29; 4 0.95,1.3; 5 -0.95,1.3
SO20W = smd 0.66 x 2.032: 1 -5.715,-5.029; 2 -4.445,-5.029; 3 -3.175,-5.029; 4 -1.905,-5.029; 5 -0.635,-5.029; 6 0.635,-5.029; 7 1.905,-5.029; 8 3.175,-5.029; 9 4.445,-5.029; 10 5.715,-5.029; 11 5.715,5.029; 12 4.445,5.029; 13 3.175,5.029; 14 1.905,5.029; 15 0.635,5.029; 16 -0.635,5.029; 17 -1.905,5.029; 18 -3.175,5.029; 19 -4.445,5.029; 20 -5.715,5.029
DIN5-RA-PTH = drill 1.4 pad 2.286: 1 7.3,12.5; 2 0,12.5; 3 -7.3,12.5; 4 5,15; 5 -5,15; 6 -5,2.8; 7 5,2.8
1X02 = drill 1.016 long: 1 -1.27,0; 2 1.27,0
DIL14S = drill 0.813: 1 -7.62,-3.81; 7 7.62,-3.81; 8 7.62,3.81; 14 -7.62,3.81
R0603 = smd 1 x 1.1: 1 -0.85,0; 2 0.85,0
0204/7 = drill 0.813 octagon: 1 -3.81,0; 2 3.81,0
0207/10 = drill 0.813 octagon: 1 -5.08,0; 2 5.08,0
0204/5 = drill 0.813 octagon: 1 -2.54,0; 2 2.54,0
M0805 = smd 1.3 x 1.6: 1 -0.95,0; 2 0.95,0
ML10 = drill 0.914 octagon: 1 -5.08,-1.27; 2 -5.08,1.27; 3 -2.54,-1.27; 4 -2.54,1.27; 5 0,-1.27; 6 0,1.27; 7 2.54,-1.27; 8 2.54,1.27; 9 5.08,-1.27; 10 5.08,1.27
ML64L = drill 0.914 pad 1.6 octagon: 1 -39.37,-1.27; 2 -39.37,1.27; 3 -36.83,-1.27; 4 -36.83,1.27; 5 -34.29,-1.27; 6 -34.29,1.27; 7 -31.75,-1.27; 8 -31.75,1.27; 9 -29.21,-1.27; 10 -29.21,1.27; 11 -26.67,-1.27; 12 -26.67,1.27; 13 -24.13,-1.27; 14 -24.13,1.27; 15 -21.59,-1.27; 16 -21.59,1.27; 17 -19.05,-1.27; 18 -19.05,1.27; 19 -16.51,-1.27; 20 -16.51,1.27; 21 -13.97,-1.27; 22 -13.97,1.27; 23 -11.43,-1.27; 24 -11.43,1.27; 25 -8.89,-1.27; 26 -8.89,1.27; 27 -6.35,-1.27; 28 -6.35,1.27; 29 -3.81,-1.27; 30 -3.81,1.27; 31 -1.27,-1.27; 32 -1.27,1.27; 33 1.27,-1.27; 34 1.27,1.27; 35 3.81,-1.27; 36 3.81,1.27; 37 6.35,-1.27; 38 6.35,1.27; 39 8.89,-1.27; 40 8.89,1.27; 41 11.43,-1.27; 42 11.43,1.27; 43 13.97,-1.27; 44 13.97,1.27; 45 16.51,-1.27; 46 16.51,1.27; 47 19.05,-1.27; 48 19.05,1.27; 49 21.59,-1.27; 50 21.59,1.27; 51 24.13,-1.27; 52 24.13,1.27; 53 26.67,-1.27; 54 26.67,1.27; 55 29.21,-1.27; 56 29.21,1.27; 57 31.75,-1.27; 58 31.75,1.27; 59 34.29,-1.27; 60 34.29,1.27; 61 36.83,-1.27; 62 36.83,1.27; 63 39.37,-1.27; 64 39.37,1.27
DIL18 = drill 0.813 long: 1 -10.16,-3.81; 2 -7.62,-3.81; 3 -5.08,-3.81; 4 -2.54,-3.81; 5 0,-3.81; 6 2.54,-3.81; 7 5.08,-3.81; 8 7.62,-3.81; 9 10.16,-3.81; 10 10.16,3.81; 11 7.62,3.81; 12 5.08,3.81; 13 2.54,3.81; 14 0,3.81; 15 -2.54,3.81; 16 -5.08,3.81; 17 -7.62,3.81; 18 -10.16,3.81
DIL24-6 = drill 0.813 long: 1 -13.97,-7.62; 2 -11.43,-7.62; 3 -8.89,-7.62; 4 -6.35,-7.62; 5 -3.81,-7.62; 6 -1.27,-7.62; 7 1.27,-7.62; 8 3.81,-7.62; 9 6.35,-7.62; 10 8.89,-7.62; 11 11.43,-7.62; 12 13.97,-7.62; 13 13.97,7.62; 14 11.43,7.62; 15 8.89,7.62; 16 6.35,7.62; 17 3.81,7.62; 18 1.27,7.62; 19 -1.27,7.62; 20 -3.81,7.62; 21 -6.35,7.62; 22 -8.89,7.62; 23 -11.43,7.62; 24 -13.97,7.62
3.2X1.5-2-PAD = smd 1.1 x 1.9: 1 -1.25,0; 2 1.25,0
22-23-2021 = drill 1 long: 1 -1.27,0; 2 1.27,0

### Placement (x,y rotation side)
BATTERY_1  13.34,34.92 180 top
C1  118.75,90.39 90 bottom
C2  20.85,69.85 180 bottom
C3  32.07,104.78 270 bottom
C4  7.37,99.06 90 bottom
C5  7.37,93.13 90 bottom
C6  13.97,101.6 180 bottom
C7  146.69,107 270 bottom
C8  139.38,107.07 270 bottom
C9  51.75,116.2 90 bottom
C10  20.95,101.6 180 bottom
C11  7.37,67.31 90 bottom
C12  72.39,116.2 90 bottom
C13  37.78,42.33 90 bottom
C14  95.25,117.79 90 bottom
C15  139.06,93.34 90 bottom
C16  140.02,24.13 270 bottom
C17  83.08,61.59 180 bottom
C18  50.16,41.67 270 bottom
C19  89.64,27.62 0 bottom
C20  40.01,38.1 0 bottom
C21  81.92,116.71 90 top
C22  63.5,109.86 0 bottom
C23  40.01,35.56 0 bottom
C24  73.34,38.73 90 bottom
C25  6.99,88.9 0 bottom
C26  60.87,4.23 270 bottom
C27  63.5,107.31 0 bottom
C28  7.37,61.28 90 bottom
C29  13.97,69.85 180 bottom
C30  6.99,57.15 0 bottom
C31  49.85,53.02 270 bottom
CON1  90.81,2.54 180 bottom
D1  30.8,43.18 180 top
D2  59.05,40.01 315 top
IC1  87.63,78.11 90 top
IC2  44.13,88.27 270 top
IC3  64.77,88.27 270 top
IC4  146.69,14.61 270 top
IC5  91.44,107.31 270 top
IC6  13.97,60.96 270 top
IC7  13.97,92.71 270 top
IC8  46.67,55.24 90 bottom
IC11  53.98,10.79 90 bottom
J1  146.69,122.56 180 top
JP1  61.59,24.77 90 top
QG1  28.26,99.69 270 top
R1  144.46,72.07 315 bottom
R2  85.09,92.08 0 bottom
R3  93.03,25.4 90 bottom
R4  81.6,33.02 90 top
R5  76.2,31.75 90 top
R6  98.11,26.67 90 bottom
R7  135.25,111.12 90 bottom
R8  143.83,112.07 90 bottom
R9  93.03,113.25 270 bottom
R10  24.13,38.1 90 bottom
R11  28.26,107.31 0 bottom
R12  127.32,95.89 180 bottom
R13  51.75,58.1 270 top
R16  61.59,20.85 270 bottom
R17  78.11,108.9 90 top
R19  69.22,104.78 90 top
SV1  15.24,76.83 0 top
SV2  156.84,56.52 270 top
SV3  15.24,45.09 0 top
U$1  107.95,88.27 270 top
U$2  30.8,30.48 270 top
U$5  129.86,78.11 270 top
X2  37.15,36.83 270 bottom
X3  13.97,108.58 90 top
X4  60.01,108.58 270 bottom

### Tracks (layer width: path | path; a pad name or v marks a point on that pad's centre or on a via)
8257_DRQ  (via drill 0.6 pad 1.42)
  Top 0.406: v111.12,64.14 v111.12,44.13
  Bottom 0.406: U$1.19 108.58,66.67 v111.12,64.14 | SV2.46 156.84,38.73 154.94,38.73 150.5,34.29 128.91,34.29 122.87,40.32 113.03,40.32 111.12,42.23 v111.12,44.13
8275_DACK  (via drill 0.6 pad 1.42)
  Top 0.406: v134.3,76.83 v134.3,89.53
  Bottom 0.406: U$1.25 119.7,74.3 120.97,75.56 123.83,75.56 125.09,76.83 v134.3,76.83 | SV2.2 156.84,94.61 154.31,94.61 153.67,93.98 153.67,92.08 152.4,90.81 135.57,90.81 v134.3,89.53
2457600HZ
  Bottom 0.406: IC2.32 39.69,92.08 38.42,90.81 35.24,90.81 33.97,92.08 QG1.8
!RESET  (via drill 0.6 pad 1.42)
  Top 0.406: v61.91,48.26 v61.91,103.5 | v98.11,51.75 98.11,39.37 v91.76,33.02
  Bottom 0.406: SV2.37 154.94,50.16 148.27,43.5 131.13,43.5 122.87,51.75 v98.11,51.75 83.19,51.75 79.69,48.26 v61.91,48.26 | CON1.41 86.68,31.43 88.27,33.02 v91.76,33.02
  Bottom 0.61: v61.91,103.5 59.69,103.5 58.42,104.78 IC3.4
A0  (via drill 0.6 pad 1.42)
  Top 0.406: v133.03,61.91 v133.03,88.27 | v77.47,64.14 v77.47,90.81 | v79.69,33.02 v79.69,29.21 | v63.18,61.28 v63.18,33.02 | v41.59,90.81 v41.59,112.39
  Bottom 0.406: SV2.15 153.99,78.11 137.79,61.91 v133.03,61.91 | v133.03,88.27 111.76,88.27 | 111.76,88.27 110.49,88.27 109.22,89.53 102.87,89.53 101.6,90.81 v77.47,90.81 60.33,90.81 59.05,92.08 IC3.9 55.24,92.08 53.98,90.81 v41.59,90.81 | IC1.27 v77.47,64.14 74.61,61.28 v63.18,61.28 | 111.76,88.27 111.76,90.49 113.35,92.08 U$1.32 | U$2.4 32.07,33.02 33.34,34.29 61.91,34.29 v63.18,33.02 v79.69,33.02 | CON1.20 82.23,26.35 79.69,28.89 v79.69,29.21 | v41.59,112.39 IC2.1
A1  (via drill 0.6 pad 1.42)
  Top 0.406: v131.76,60.64 v131.76,94.61 | v83.5,29.21 v83.5,31.75 | v68.58,93.34 v68.58,31.75 | v42.86,95.89 v42.86,107.31
  Bottom 0.406: SV2.16 156.84,76.83 153.99,76.83 137.79,60.64 v131.76,60.64 | v131.76,94.61 U$1.33 114.62,94.61 112.08,92.08 102.87,92.08 101.6,93.34 v68.58,93.34 67.63,93.34 65.09,95.89 v42.86,95.89 | U$2.5 32.07,30.48 33.34,31.75 v68.58,31.75 v83.5,31.75 | CON1.19 v83.5,29.21 | IC2.3 v42.86,107.31
A2  (via drill 0.6 pad 1.42)
  Top 0.406: v130.49,61.91 v130.49,97.16 | v49.21,100.97 v49.21,29.21
  Bottom 0.406: SV2.17 153.99,75.56 137.79,59.37 131.13,59.37 130.49,60.01 v130.49,61.91 | v130.49,97.16 U$1.34 109.86,97.16 106.05,100.97 99.06,100.97 95.89,97.79 84.45,97.79 83.82,98.42 83.82,100.33 83.19,100.97 v49.21,100.97 47.31,100.97 46.04,102.23 IC2.5 | U$2.6 32.07,27.94 33.34,29.21 v49.21,29.21 50.48,30.48 84.14,30.48 84.77,29.84 CON1.18
A3  (via drill 0.6 pad 1.42)
  Top 0.406: v129.22,60.64 v129.22,99.69 | v102.23,103.5 v102.23,54.29 | v73.34,49.53 v73.34,28.89 | v136.84,19.68 v136.84,57.78 | v44.13,49.53 v44.13,99.69
  Bottom 0.406: SV2.18 156.84,74.3 153.99,74.3 137.48,57.78 v136.84,57.78 130.81,57.78 129.22,59.37 v129.22,60.64 | v129.22,99.69 U$1.35 109.86,99.69 106.05,103.5 v102.23,103.5 | U$2.7 32.07,25.4 33.34,26.67 54.61,26.67 56.83,28.89 v73.34,28.89 | IC4.14 149.22,18.41 147.96,19.68 v136.84,19.68 | v44.13,49.53 v73.34,49.53 79.69,49.53 82.87,52.7 90.49,52.7 92.08,54.29 v102.23,54.29 | v44.13,99.69 IC2.6
A4  (via drill 0.6 pad 1.42)
  Top 0.406: v127.95,61.91 v127.95,104.78 | v135.57,20.95 v135.57,56.2
  Bottom 0.406: SV2.19 153.99,73.03 137.16,56.2 v135.57,56.2 131.13,56.2 127.95,59.37 v127.95,61.91 | v127.95,104.78 U$1.37 | IC4.13 152.08,15.88 152.72,16.51 152.72,19.05 152.08,19.68 149.22,19.68 147.96,20.95 IC4.2 v135.57,20.95
A5  (via drill 0.6 pad 1.42)
  Top 0.406: v126.68,60.64 v126.68,107.31
  Bottom 0.406: SV2.20 156.84,71.75 153.99,71.75 136.84,54.61 131.44,54.61 126.68,59.37 v126.68,60.64 | v126.68,107.31 U$1.38
A6  (via drill 0.6 pad 1.42)
  Top 0.406: v125.41,61.91 v125.41,109.86
  Bottom 0.406: SV2.21 153.99,70.48 137.16,53.66 131.13,53.66 125.41,59.37 v125.41,61.91 | v125.41,109.86 U$1.39
A7  (via drill 0.6 pad 1.42)
  Top 0.406: v124.14,60.64 v124.14,112.39
  Bottom 0.406: SV2.22 156.84,69.22 153.99,69.22 137.48,52.7 130.81,52.7 124.14,59.37 v124.14,60.64 | U$1.40 v124.14,112.39
A8  (via drill 0.6 pad 1.42)
  Top 0.406: v147.32,85.72 v147.32,60.96
  Bottom 0.406: U$5.4 134.94,84.45 136.21,85.72 v147.32,85.72 | SV2.23 154.94,67.94 147.96,60.96 v147.32,60.96
A9  (via drill 0.6 pad 1.42)
  Top 0.406: v146.05,84.45 v146.05,59.37
  Bottom 0.406: U$5.21 v146.05,84.45 | SV2.24 156.84,66.67 154.94,66.67 147.64,59.37 v146.05,59.37
A10  (via drill 0.6 pad 1.42)
  Top 0.406: v144.78,80.64 v144.78,58.1
  Bottom 0.406: U$5.6 134.94,79.38 136.21,80.64 v144.78,80.64 | SV2.25 154.94,65.41 147.64,58.1 v144.78,58.1
A11  (via drill 0.6 pad 1.42)
  Top 0.406: v143.51,79.38 v143.51,56.83
  Bottom 0.406: U$5.19 v143.51,79.38 | SV2.26 156.84,64.14 154.94,64.14 147.64,56.83 v143.51,56.83
A12  (via drill 0.6 pad 1.42)
  Top 0.406: v134.3,74.3 135.57,73.03 135.57,61.91 138.43,59.05 v138.43,51.75
  Bottom 0.406: SV2.27 154.94,62.87 147.64,55.56 141.6,55.56 138.43,52.39 v138.43,51.75
  Bottom 0.61: v134.3,74.3 U$5.8
A13  (via drill 0.6 pad 1.42)
  Top 0.406: v142.24,75.56 v142.24,54.29
  Bottom 0.406: SV2.28 156.84,61.59 154.94,61.59 147.64,54.29 v142.24,54.29
  Bottom 0.61: U$5.17 140.97,74.3 v142.24,75.56
A14  (via drill 0.6 pad 1.42)
  Top 0.406: v134.3,69.22 v134.3,50.48
  Bottom 0.406: SV2.29 154.94,60.33 147.64,53.02 140.34,53.02 139.7,52.39 139.7,51.12 139.06,50.48 v134.3,50.48 | U$5.10 v134.3,69.22
A15  (via drill 0.6 pad 1.42)
  Top 0.406: v140.97,70.48 v140.97,51.75
  Bottom 0.406: SV2.30 156.84,59.05 154.94,59.05 147.64,51.75 v140.97,51.75
  Bottom 0.61: U$5.15 139.7,69.22 v140.97,70.48
ADSTB  (via drill 0.6 pad 1.42)
  Top 0.406: v111.12,70.17 v111.12,93.34
  Bottom 0.406: U$5.11 120.65,66.67 119.38,65.41 114.3,65.41 111.12,68.58 v111.12,70.17 | v111.12,93.34 102.87,93.34 101.6,94.61 U$1.8
AEN  (via drill 0.6 pad 1.42)
  Top 0.406: v148.91,74.61 v148.91,38.42 | v109.86,45.4 v109.86,90.81
  Bottom 0.406: U$5.13 138.43,64.14 v148.91,74.61 | SV2.42 156.84,43.81 154.94,43.81 149.54,38.42 v148.91,38.42 129.86,38.42 122.87,45.4 v109.86,45.4 | U$1.9 101.6,92.08 102.87,90.81 v109.86,90.81
CF_CS0
  Bottom 0.406: CON1.7 98.74,23.81 99.38,24.45 115.89,24.45 117.79,22.54 117.79,13.34 | IC11.19 107,6.35 113.98,13.34 117.79,13.34 | IC4.5 117.79,13.34
CF_D0
  Bottom 0.406: CON1.21 80.96,24.77 77.79,27.94 75.56,27.94 73.98,26.35 66.67,26.35 64.14,23.81 64.14,20 60.64,16.51 IC11.11
CF_D1
  Bottom 0.406: IC11.12 60.64,15.24 65.09,19.68 65.09,23.5 66.99,25.4 77.79,25.4 79.69,23.5 CON1.22
CF_D2
  Bottom 0.406: IC11.13 60.64,13.97 66.04,19.37 66.04,23.18 67.31,24.45 77.47,24.45 78.42,23.5 CON1.23
CF_D3
  Bottom 0.406: IC11.18 98.42,7.62 105.09,14.29 CON1.2
CF_D4
  Bottom 0.406: IC11.17 98.42,8.89 103.82,14.29 CON1.3
CF_D5
  Bottom 0.406: IC11.16 98.42,10.16 102.55,14.29 CON1.4
CF_D6
  Bottom 0.406: IC11.15 98.42,11.43 101.28,14.29 CON1.5
CF_D7
  Bottom 0.406: IC11.14 98.42,12.7 100.01,14.29 CON1.6
CLK  (via drill 0.6 pad 1.42)
  Top 0.406: v92.71,83.19 v92.71,53.02
  Bottom 0.406: SV2.36 156.84,51.44 154.94,51.44 147.96,44.45 131.44,44.45 122.87,53.02 v92.71,53.02 | v92.71,83.19 96.52,83.19 97.79,84.45 U$1.12
COM1_CTS  (via drill 0.6 pad 1.42)
  Top 0.406: v17.78,80.33 v10.16,80.33
  Bottom 0.61: v10.16,80.33 IC7.8 | SV1.8 v17.78,80.33
COM1_RXD
  Bottom 0.406: IC7.13 15.88,93.98 13.97,92.08 13.97,80.01 13.34,79.38 12.06,79.38 11.43,78.74 11.43,76.83 SV1.1
COM1_TXD
  Bottom 0.406: IC7.14 19.68,96.52 20.32,95.89 20.32,93.34 19.68,92.71 15.88,92.71 15.24,92.08 15.24,80.01 13.97,78.74 13.97,76.83 SV1.3
CS_0
  Bottom 0.406: SV2.57 155.26,24.77 152.4,27.62 126.68,27.62 120.65,33.66 110.81,33.66 101.6,42.86 88.58,42.86 85.41,46.04 32.7,46.04 31.75,45.09 31.75,39.69 30.16,38.1 U$2.2
CS_1
  Bottom 0.406: SV2.58 156.84,23.5 153.03,23.5 151.76,22.23 149.22,22.23 147.96,23.5 IC4.1
CS_2
  Bottom 0.406: SV2.59 153.67,22.23 152.4,20.95 IC4.15
CS_DMA  (via drill 0.6 pad 1.42)
  Top 0.406: v119.06,85.72 v119.06,15.88
  Bottom 0.406: U$1.11 101.6,87 102.87,85.72 v119.06,85.72 | IC4.4 v119.06,15.88
CS_INT  (via drill 0.6 pad 1.42)
  Top 0.406: v95.25,59.69 v95.25,39.69 | v121.92,9.53 v121.92,27.3
  Bottom 0.406: IC4.9 145.41,5.71 144.15,6.99 141.29,6.99 138.75,9.53 122.87,9.53 | v95.25,39.69 100.97,39.69 109.86,30.8 118.43,30.8 v121.92,27.3
  Bottom 0.61: 122.87,9.53 v121.92,9.53 | IC1.1 v95.25,59.69
CTS1_TTL  (via drill 0.6 pad 1.42)
  Top 0.406: v38.73,80.64 v38.73,97.16
  Bottom 0.406: v38.73,97.16 IC2.7 | v38.73,80.64 23.5,80.64 20.32,83.82 IC7.9
CTS2_TTL  (via drill 0.6 pad 1.42)
  Top 0.406: v40.01,104.78 v40.01,75.56
  Bottom 0.406: IC2.4 v40.01,104.78 | v40.01,75.56 34.92,75.56 33.97,74.61 33.97,69.85 27.94,63.82 27.94,55.88 24.13,52.07 IC6.9
D0  (via drill 0.6 pad 1.42)
  Top 0.406: v46.67,30.48 v46.67,73.03 | v41.59,15.24 v41.59,30.48 | v63.18,78.11 v63.18,84.45
  Bottom 0.406: SV2.7 136.21,88.27 134.94,87 U$5.3 U$1.30 102.87,87 101.6,88.27 97.47,88.27 96.2,87 IC1.11 92.08,87 90.81,85.72 69.85,85.72 68.58,84.45 v63.18,84.45 IC3.12 | IC11.9 v41.59,15.24 | v63.18,78.11 55.88,78.11 54.93,77.15 54.93,76.2 53.02,74.3 IC2.25 50.48,74.3 49.21,73.03 v46.67,73.03 | U$2.14 v41.59,30.48 v46.67,30.48
D1  (via drill 0.6 pad 1.42)
  Top 0.406: v47.94,74.3 v47.94,27.94 | v43.18,13.97 v43.18,27.94
  Bottom 0.406: SV2.8 156.84,87 U$5.22 136.21,87 134.94,85.72 120.97,85.72 119.7,84.45 U$1.29 102.87,84.45 101.6,85.72 97.47,85.72 96.2,84.45 IC1.10 92.08,84.45 90.81,83.19 69.85,83.19 68.58,81.92 IC3.13 55.88,81.92 53.98,80.01 53.98,76.52 53.02,75.56 50.48,75.56 49.21,74.3 v47.94,74.3 IC2.16 | IC11.8 v43.18,13.97 | v47.94,27.94 v43.18,27.94 U$2.13
D2  (via drill 0.6 pad 1.42)
  Top 0.406: v39.05,25.4 v39.05,70.48 | v44.45,12.7 v44.45,25.4 | v59.37,79.38 v59.37,73.03
  Bottom 0.406: SV2.9 149.86,85.72 147.32,83.19 136.21,83.19 134.94,81.92 U$5.5 U$1.28 102.87,81.92 101.6,83.19 97.79,83.19 96.52,81.92 IC1.9 93.98,81.92 92.71,80.64 78.74,80.64 76.2,78.11 65.09,78.11 63.82,79.38 v59.37,79.38 | IC11.7 v44.45,12.7 | v59.37,73.03 55.88,73.03 54.61,71.75 IC2.24 50.48,71.75 49.21,70.48 v39.05,70.48 | U$2.12 v39.05,25.4 v44.45,25.4
  Bottom 0.61: IC3.14 v59.37,79.38
D3  (via drill 0.6 pad 1.42)
  Top 0.406: v40.32,22.86 v40.32,71.75 | v46.99,22.86 v46.99,6.35
  Bottom 0.406: SV2.10 156.84,84.45 149.86,84.45 147.32,81.92 U$5.20 136.21,81.92 134.94,80.64 120.97,80.64 119.7,79.38 U$1.27 102.87,79.38 101.6,80.64 97.79,80.64 96.52,79.38 IC1.8 93.98,79.38 92.71,78.11 78.74,78.11 76.2,75.56 63.5,75.56 62.23,76.83 IC3.15 56.83,76.83 53.02,73.03 50.48,73.03 49.21,71.75 v40.32,71.75 IC2.17 | IC11.2 v46.99,6.35 | U$2.11 v40.32,22.86 v46.99,22.86
D4  (via drill 0.6 pad 1.42)
  Top 0.406: v30.16,51.44 v30.16,10.48 | v63.18,70.48 v63.18,73.03
  Bottom 0.406: SV2.11 149.86,83.19 144.78,78.11 124.78,78.11 123.51,76.83 U$5.7 U$1.26 102.87,76.83 101.6,78.11 97.79,78.11 96.52,76.83 IC1.7 93.98,76.83 92.71,75.56 78.74,75.56 76.2,73.03 v63.18,73.03 61.91,74.3 IC3.16 | v30.16,10.48 34.29,10.48 37.15,7.62 IC11.3 | IC2.23 52.7,69.22 | v63.18,70.48 55.88,70.48 54.61,69.22 IC2.23 | IC2.23 50.48,69.22 49.21,67.94 34.61,67.94 30.16,63.5 v30.16,51.44
D5  (via drill 0.6 pad 1.42)
  Top 0.406: v28.89,52.7 v28.89,11.75
  Bottom 0.406: SV2.12 156.84,81.92 149.86,81.92 144.78,76.83 U$5.18 136.21,76.83 135.57,76.2 135.57,73.66 134.94,73.03 120.65,73.03 119.06,71.44 119.06,69.85 118.43,69.22 U$1.23 114.3,69.22 113.67,69.85 113.67,71.12 110.49,74.3 102.87,74.3 101.6,75.56 97.79,75.56 96.52,74.3 IC1.6 93.98,74.3 92.71,73.03 78.74,73.03 76.2,70.48 65.09,70.48 63.82,71.75 IC3.17 55.88,71.75 54.61,70.48 50.48,70.48 49.21,69.22 IC2.18 34.61,69.22 28.89,63.5 v28.89,52.7 | v28.89,11.75 34.29,11.75 37.15,8.89 IC11.4
D6  (via drill 0.6 pad 1.42)
  Top 0.406: v32.7,51.44 v32.7,13.02 | v59.37,65.41 v59.37,67.94
  Bottom 0.406: SV2.13 149.86,80.64 142.24,73.03 136.21,73.03 134.94,71.75 U$5.9 120.65,71.75 120.02,71.12 120.02,67.63 119.06,66.67 U$1.22 114.3,66.67 112.71,68.26 112.71,70.8 111.76,71.75 102.87,71.75 101.6,73.03 97.79,73.03 96.52,71.75 IC1.5 93.98,71.75 92.71,70.48 78.74,70.48 76.2,67.94 v59.37,67.94 | IC11.5 37.15,10.16 34.29,13.02 v32.7,13.02 | v59.37,65.41 55.88,65.41 54.61,66.67 IC2.22 50.48,66.67 49.21,65.41 34.61,65.41 32.7,63.5 v32.7,51.44
  Bottom 0.61: IC3.18 58.1,69.22 v59.37,67.94
D7  (via drill 0.6 pad 1.42)
  Top 0.406: v31.43,52.7 v31.43,14.29
  Bottom 0.406: SV2.14 156.84,79.38 149.86,79.38 142.24,71.75 U$5.16 136.21,71.75 135.57,71.12 135.57,67.31 133.67,65.41 120.65,65.41 119.38,64.14 U$1.21 114.3,64.14 109.22,69.22 102.87,69.22 101.6,70.48 97.79,70.48 96.52,69.22 IC1.4 93.98,69.22 92.71,67.94 78.74,67.94 77.47,66.67 74.93,66.67 73.66,65.41 71.12,65.41 69.85,66.67 IC3.19 55.88,66.67 54.61,67.94 50.48,67.94 49.21,66.67 IC2.19 34.61,66.67 31.43,63.5 v31.43,52.7 | IC11.6 37.15,11.43 34.29,14.29 v31.43,14.29
DACK1  (via drill 0.6 pad 1.42)
  Top 0.406: v117.79,71.75 v117.79,44.13
  Bottom 0.406: v117.79,44.13 122.87,44.13 129.86,37.15 149.54,37.15 154.94,42.55 SV2.43
  Bottom 0.61: U$1.24 v117.79,71.75
DACK2  (via drill 0.6 pad 1.42)
  Top 0.406: v112.39,78.11 v112.39,42.86
  Bottom 0.406: SV2.44 156.84,41.27 154.94,41.27 149.86,36.2 129.54,36.2 122.87,42.86 v112.39,42.86 | U$1.14 101.6,79.38 102.87,78.11 v112.39,78.11
DACK3  (via drill 0.6 pad 1.42)
  Top 0.406: v113.67,75.56 v113.67,41.59
  Bottom 0.406: U$1.15 101.6,76.83 102.87,75.56 v113.67,75.56 | v113.67,41.59 122.87,41.59 129.22,35.24 150.18,35.24 154.94,40.01 SV2.45
DRQ1  (via drill 0.6 pad 1.42)
  Top 0.406: v91.44,66.67 v91.44,50.48
  Bottom 0.406: SV2.47 154.94,37.47 150.81,33.34 128.59,33.34 122.56,39.37 112.71,39.37 101.6,50.48 v91.44,50.48 | U$1.18 97.79,69.22 96.52,67.94 93.98,67.94 92.71,66.67 v91.44,66.67
DRQ2  (via drill 0.6 pad 1.42)
  Top 0.406: v90.17,69.22 v90.17,49.21
  Bottom 0.406: U$1.17 97.79,71.75 96.52,70.48 93.98,70.48 92.71,69.22 v90.17,69.22 | SV2.48 156.84,36.2 154.94,36.2 151.13,32.38 128.27,32.38 122.24,38.42 112.39,38.42 101.6,49.21 v90.17,49.21
DRQ3  (via drill 0.6 pad 1.42)
  Top 0.406: v88.9,71.75 v88.9,50.48
  Bottom 0.406: U$1.16 97.79,74.3 96.52,73.03 93.98,73.03 92.71,71.75 v88.9,71.75 | SV2.49 154.94,34.92 151.45,31.43 127.95,31.43 121.92,37.47 112.08,37.47 101.6,47.94 89.53,47.94 88.9,48.58 v88.9,50.48
GND  (via drill 0.6 pad 1.42)
  Top 0.61: v92.39,99.69 v92.39,94.61 | v144.78,93.98 v144.78,101.6 | v97.79,103.44 v97.79,65.41 | v97.79,117.16 v97.79,106.05 | v57.15,38.73 v57.15,25.72 | v146.69,10.16 v146.69,3.17 | v63.18,14.29 v63.18,4.13 | v116.2,15.56 v116.2,11.11 | v64.45,104.78 v64.45,117.16
  Bottom 0.406: CON1.50 75.25,17.46 86.04,17.46 | 86.04,17.46 87.31,17.46 | 87.31,17.46 88.58,17.46 | 89.85,17.46 92.39,17.46 | 92.39,17.46 93.66,17.46 | 93.66,17.46 94.93,17.46 | 94.93,17.46 96.2,17.46 | 96.2,17.46 97.47,17.46 CON1.8 | CON1.9 96.2,17.46 | CON1.10 94.93,17.46 | CON1.11 93.66,17.46 | CON1.12 92.39,17.46 | CON1.14 89.85,17.46 | CON1.39 89.22,17.46 | 89.22,17.46 89.85,17.46 | 88.58,17.46 CON1.15 88.58,26.04 88.27,26.04 | 88.58,17.46 89.22,17.46 | CON1.16 87.31,17.46 | CON1.17 86.04,17.46 | CON1.1 106.36,17.46
  pour Bottom (isolate 0.406, no thermals): 0,122.56 0,0 167.64,0 167.64,122.56
HLDA  (via drill 0.6 pad 1.42)
  Top 0.406: v104.78,50.48 v104.78,97.16
  Bottom 0.406: SV2.38 156.84,48.9 154.94,48.9 148.59,42.55 130.81,42.55 122.87,50.48 v104.78,50.48 | v104.78,97.16 U$1.7
HRQ  (via drill 0.6 pad 1.42)
  Top 0.406: v108.58,46.67 v108.58,88.27
  Bottom 0.406: SV2.41 154.94,45.09 149.54,39.69 129.86,39.69 122.87,46.67 v108.58,46.67 | v108.58,88.27 102.87,88.27 101.6,89.53 U$1.10
INT  (via drill 0.6 pad 1.42)
  Top 0.406: v76.2,50.8 v76.2,89.53
  Bottom 0.406: SV2.32 156.84,56.52 154.94,56.52 146.69,48.26 132.72,48.26 123.19,57.78 96.84,57.78 95.25,56.2 91.44,56.2 90.81,55.56 80.96,55.56 v76.2,50.8 | v76.2,89.53 IC1.17
INTA  (via drill 0.6 pad 1.42)
  Top 0.406: v82.55,54.29 v82.55,66.67
  Bottom 0.406: SV2.33 154.94,55.24 147,47.31 132.4,47.31 122.87,56.83 97.16,56.83 95.57,55.24 91.76,55.24 90.81,54.29 v82.55,54.29 | v82.55,66.67 IC1.26
IO_RD  (via drill 0.6 pad 1.42)
  Top 0.406: v114.94,55.56 v114.94,62.23 | v42.86,35.56 v42.86,93.34 | v133.35,97.47 v133.35,109.86 | v51.44,24.13 v51.44,35.56 | v64.45,94.61 v64.45,62.55 | v45.72,24.13 v45.72,5.08
  Bottom 0.406: v114.94,55.56 122.87,55.56 132.08,46.35 147.32,46.35 154.94,53.98 156.21,53.98 157.48,55.24 SV2.34 159.7,56.83 159.7,96.52 158.75,97.47 v133.35,97.47 | v114.94,62.23 109.22,67.94 97.79,67.94 96.52,66.67 IC1.3 93.98,66.67 92.71,65.41 76.2,65.41 73.34,62.55 v64.45,62.55 | CON1.34 95.57,33.97 93.98,35.56 v51.44,35.56 v42.86,35.56 | v64.45,94.61 IC3.8 55.24,94.61 53.98,93.34 v42.86,93.34 39.69,93.34 38.42,92.08 IC2.9 | U$2.8 32.07,22.86 33.34,24.13 v45.72,24.13 v51.44,24.13 | v45.72,5.08 IC11.1 | U$1.2 113.03,109.86 114.3,111.12 126.05,111.12 127.32,109.86 v133.35,109.86
IO_WR  (via drill 0.6 pad 1.42)
  Top 0.406: v97.79,55.56 v97.79,62.87 | v69.85,60.01 v69.85,89.53 | v111.12,103.5 v111.12,112.39 | v64.77,27.62 v64.77,34.29 | v99.38,55.56 99.38,38.1 v94.3,33.02 | v46.99,88.27 v46.99,94.61
  Bottom 0.406: v111.12,103.5 133.35,103.5 138.43,98.42 159.07,98.42 160.66,96.84 160.66,55.56 159.07,53.98 157.48,53.98 156.21,52.7 SV2.35 154.94,52.7 147.64,45.4 131.76,45.4 122.87,54.29 114.3,54.29 113.03,55.56 v99.38,55.56 | v111.12,112.39 U$1.1 | CON1.35 v94.3,33.02 93.03,34.29 v64.77,34.29 | U$2.10 49.53,20.32 56.83,27.62 v64.77,27.62 | v97.79,62.87 96.52,64.14 IC1.2 82.55,64.14 81.28,62.87 78.74,62.87 75.88,60.01 v69.85,60.01 | v69.85,89.53 IC3.10 55.24,89.53 53.98,88.27 v46.99,88.27 | v46.99,94.61 IC2.8
  Bottom 0.61: v97.79,55.56 v99.38,55.56
IRQ5  (via drill 0.6 pad 1.42)
  Top 0.406: v87.63,49.21 v87.63,74.3
  Bottom 0.406: v87.63,74.3 IC1.23 | SV2.50 156.84,33.66 154.94,33.66 151.76,30.48 127.64,30.48 121.6,36.51 111.76,36.51 101.6,46.67 89.22,46.67 87.63,48.26 v87.63,49.21
IRQ6  (via drill 0.6 pad 1.42)
  Top 0.406: v86.36,50.48 v86.36,71.75
  Bottom 0.406: v86.36,71.75 IC1.24 | SV2.51 154.94,32.38 152.08,29.53 127.32,29.53 121.28,35.56 111.44,35.56 101.6,45.4 88.9,45.4 86.36,47.94 v86.36,50.48
IRQ7  (via drill 0.6 pad 1.42)
  Top 0.406: v85.09,69.22 v85.09,49.21
  Bottom 0.406: IC1.25 v85.09,69.22 | SV2.52 156.84,31.11 154.94,31.11 152.4,28.57 127,28.57 120.97,34.61 111.12,34.61 101.6,44.13 88.58,44.13 85.09,47.62 v85.09,49.21
KBD_CS  (via drill 0.6 pad 1.42)
  Top 0.406: v60.64,99.69 v60.64,43.5 | v123.83,10.79 v123.83,27.3
  Bottom 0.406: v60.64,43.5 85.41,43.5 87.95,40.96 100.97,40.96 110.17,31.75 119.38,31.75 v123.83,27.3 | IC4.10 145.41,8.26 144.15,9.53 140.97,9.53 139.7,10.79 v123.83,10.79
  Bottom 0.61: IC3.6 v60.64,99.69
KBD_IRQ  (via drill 0.6 pad 1.42)
  Top 0.406: v82.55,87 v82.55,99.69
  Bottom 0.406: IC1.18 v82.55,87 | v82.55,99.69 IC3.35
KCLK
  Bottom 0.406: R7.1 90.17,108.58 88.9,107.31 IC5.4 86.68,107.31 85.72,106.36 76.83,106.36 73.98,103.5 68.58,103.5 67.94,104.14 67.94,111.76 67.31,112.39 IC3.1
  Bottom 0.61: C8.1 J1.1 138,110.06 136.53,108.58 R7.1
KDAT
  Bottom 0.406: IC3.39 85.09,109.86 86.36,111.12 88.9,111.12 90.17,109.86 IC5.12 97.79,109.86 99.06,111.12 111.76,111.12 114.3,113.67 126.05,113.67 127.64,112.08 140.65,112.08 141.6,111.12 R8.1 144.14,111.12 144.15,111.12
  Bottom 0.61: C7.1 J1.2 145.62,111.12 144.14,111.12
N$1
  Bottom 0.406: U$5.14 139.06,66.67 R1.2 | R1.2
N$2
  Bottom 0.61: IC1.16 R2.2
N$3
  Bottom 0.406: IC3.38 71.12,107.31 70.48,107.95 70.48,110.49 71.12,111.12 82.55,111.12 86.36,114.94 IC5.1
N$4
  Bottom 0.406: CON1.36 R3.1
N$5
  Bottom 0.406: U$1.6 106.05,99.69 109.86,95.89 R12.1
N$6
  Bottom 0.61: QG1.1 R11.2
N$7  (via drill 0.6 pad 1.27)
  other vias: 5,5
N$8  (via drill 0.6 pad 1.42)
  Top 0.406: v55.56,55.88 v55.56,61.91
  Bottom 0.406: v55.56,55.88 51.44,55.88 50.8,55.24 IC8.2
  Bottom 0.61: IC2.21 R13.1 v55.56,61.91
N$9
  Bottom 0.406: IC7.1 7.94,101.6 7.37,101.03 C4.2
N$10
  Bottom 0.406: C5.2 IC7.4
N$11
  Bottom 0.406: IC7.5 9.21,91.44 8.37,92.28 C5.1
N$12
  Bottom 0.406: IC7.3 7.94,96.52 7.37,97.09 C4.1
N$13
  Bottom 0.61: IC7.2 12.38,99.06 13.12,99.8 C6.1
N$14
  Bottom 0.61: C25.1 IC7.6
N$15  (via drill 0.6 pad 1.42)
  Top 0.406: v12.38,49.85 v19.05,49.85
  Bottom 0.406: 10.79,54.61 11.43,54.61 12.38,53.66 v12.38,49.85 | v19.05,49.85 19.05,45.09 SV3.7
  Bottom 0.61: 10.79,54.61 IC6.7
N$16
  Bottom 0.406: IC6.1 7.94,69.85 7.37,69.28 C11.2
N$17
  Bottom 0.406: IC5.3 87.31,109.86 84.77,107.31 76.52,107.31 73.98,104.78 IC3.37
N$18  (via drill 0.6 pad 1.42)
  Top 0.406: v12.38,81.6 v19.05,81.6
  Bottom 0.406: IC7.7 11.43,86.36 12.38,85.41 v12.38,81.6 | v19.05,81.6 19.05,76.83 SV1.7
N$19
  Bottom 0.406: CON1.44 82.87,26.99 81.6,28.26 R4.1
N$20
  Bottom 0.406: R9.2 92.71,112.4 92.71,112.39
  Bottom 0.61: IC5.2 92.71,112.39 IC5.13
N$21
  Bottom 0.406: CON1.46 80.33,24.13 77.79,26.67 R5.1
N$22
  Bottom 0.813: BATTERY_1.+ 20.32,34.92 21.59,36.2 21.59,41.27 23.5,43.18 D1.A
N$23  (via drill 0.6 pad 1.27)
  other vias: 24.37,117.39
N$24  (via drill 0.6 pad 1.27)
  other vias: 162.48,5
N$25  (via drill 0.6 pad 1.27)
  other vias: 162.48,117.39
N$26
  Bottom 0.406: IC6.4 7.47,62.23 C28.2
N$27
  Bottom 0.406: IC6.5 8.89,59.69 8.26,60.33 7.47,60.33 C28.1
N$29
  Bottom 0.406: CON1.32 R6.1
N$30
  Bottom 0.406: IC6.3 7.94,64.77 7.37,65.34 C11.1
N$31
  Bottom 0.61: IC6.2 12.38,67.31 13.12,68.05 C29.1
N$32  (via drill 0.6 pad 1.42)
  Top 0.406: v89.85,79.38 v89.85,102.23
  Bottom 0.406: IC1.21 v89.85,79.38 | R17.1 83.19,105.09 86.04,102.23 IC5.6
  Bottom 0.61: v89.85,102.23 IC5.6
N$33
  Bottom 0.406: CON1.45 81.6,25.4 78.11,28.89 75.25,28.89 73.66,27.3 66.36,27.3 65.09,26.04 JP1.2
N$34
  Bottom 0.61: R16.1 JP1.1
N$35
  Bottom 0.406: R19.1 IC3.5
N$36
  Bottom 0.406: IC6.13 15.88,62.23 13.97,60.33 13.97,48.26 13.34,47.62 12.06,47.62 11.43,46.99 11.43,45.09 SV3.1
N$37  (via drill 0.6 pad 1.27)
  other vias: 26.91,5
N$38
  Bottom 0.406: IC6.14 19.68,64.77 20.32,64.14 20.32,61.59 19.68,60.96 15.88,60.96 15.24,60.33 15.24,48.26 13.97,46.99 13.97,45.09 SV3.3
N$39  (via drill 0.6 pad 1.42)
  Top 0.406: v17.78,48.58 v10.16,48.58
  Bottom 0.61: v10.16,48.58 IC6.8 | SV3.8 v17.78,48.58
N$40
  Bottom 0.61: C30.1 IC6.6
N$42  (via drill 0.6 pad 1.27)
  other vias: 5,117.39
RD  (via drill 0.6 pad 1.42)
  Top 0.406: v106.05,49.21 v106.05,107.31
  Bottom 0.406: SV2.39 154.94,47.62 148.91,41.59 130.49,41.59 122.87,49.21 v106.05,49.21 | U$1.3 v106.05,107.31
RESET  (via drill 0.6 pad 1.42)
  Top 0.406: v103.5,80.64 v103.5,59.05 | v54.29,50.8 v54.29,97.16
  Bottom 0.406: SV2.31 154.94,57.78 146.37,49.21 133.03,49.21 123.19,59.05 v103.5,59.05 96.84,59.05 94.93,57.15 91.12,57.15 90.49,56.52 80.01,56.52 74.3,50.8 v54.29,50.8 | U$1.13 101.6,81.92 102.87,80.64 v103.5,80.64
  Bottom 0.61: v54.29,97.16 IC2.34
RTC_IRQ  (via drill 0.6 pad 1.42)
  Top 0.406: v85.41,104.78 85.41,72.71 83.82,71.12 v83.82,50.48
  Bottom 0.406: R10.2 24.13,40.01 24.77,40.64 U$2.1 30.16,40.64 30.8,41.27 30.8,45.4 32.38,46.99 80.33,46.99 v83.82,50.48
  Bottom 0.61: IC5.5 v85.41,104.78
RTS1_TTL
  Bottom 0.406: IC2.29 39.37,84.45 38.1,83.19 23.5,83.19 20.32,86.36 IC7.10
RTS2_TTL  (via drill 0.6 pad 1.42)
  Top 0.406: v32.7,84.45 v32.7,70.48
  Bottom 0.406: IC2.12 v32.7,84.45 | v32.7,70.48 26.99,64.77 26.99,57.78 23.81,54.61 IC6.10
RXD1_TTL
  Bottom 0.406: IC2.31 39.37,89.53 38.1,88.27 23.5,88.27 20.32,91.44 IC7.12
RXD2_TTL  (via drill 0.6 pad 1.42)
  Top 0.406: v28.89,89.53 v28.89,70.48
  Bottom 0.406: IC2.10 v28.89,89.53 | v28.89,70.48 25.08,66.67 25.08,62.55 22.23,59.69 IC6.12
SOSCI
  Bottom 0.61: U$2.17 37.78,38.1 | 37.78,38.1 C20.2 | X2.1 37.78,38.1
SOSCO
  Bottom 0.61: U$2.16 37.78,35.56 | 37.78,35.56 C23.2 | X2.2 37.78,35.56
TC_8257  (via drill 0.6 pad 1.42)
  Top 0.406: v135.25,99.69 v139.06,99.69
  Bottom 0.406: U$1.36 132.72,102.23 v135.25,99.69 | v139.06,99.69 159.07,99.69 161.61,97.16 161.61,55.24 159.7,53.34 159.7,31.43 SV2.54
TXD1_TTL
  Bottom 0.406: IC2.30 39.37,87 38.1,85.72 23.5,85.72 20.32,88.9 IC7.11
TXD2_TTL  (via drill 0.6 pad 1.42)
  Top 0.406: v30.8,87 v30.8,70.48
  Bottom 0.406: IC2.11 v30.8,87 | v30.8,70.48 26.04,65.72 26.04,60.33 22.86,57.15 IC6.11
UART_CS  (via drill 0.6 pad 1.42)
  Top 0.406: v45.4,97.16 v45.4,44.77 | v148.27,13.34 v148.27,26.35
  Bottom 0.406: v45.4,44.77 85.41,44.77 88.27,41.91 101.28,41.91 110.49,32.7 120.33,32.7 126.68,26.35 v148.27,26.35 | IC2.35 47.94,99.69 v45.4,97.16
  Bottom 0.61: IC4.12 v148.27,13.34
UART_RX_IRQ  (via drill 0.6 pad 1.42)
  Top 0.406: v74.61,80.64 v74.61,58.74
  Bottom 0.406: IC1.20 78.11,81.92 76.83,80.64 v74.61,80.64 | v74.61,58.73 v74.61,58.74 73.03,57.15 51.44,57.15 50.48,56.2 IC8.4
VCC  (via drill 0.6 pad 1.42)
  Top 0.406: v151.76,78.11 v151.76,92.08 | v55.88,36.83 v55.88,33.02 | v91.12,92.08 v91.12,114.94
  Top 0.61: v113.03,89.53 v113.03,114.94 | v67.31,76.83 v67.31,114.94 | v67.31,74.3 v67.31,55.88 | v152.4,104.78 v152.4,95.89 | v71.12,36.83 v71.12,55.88 | v65.72,76.83 v65.72,74.3 | v90.49,29.21 v98.11,29.21 | v58.74,18.73 v58.74,36.83 | v4.45,107.31 v4.45,71.75
  Bottom 0.406: v151.76,78.11 150.5,78.11 R1.1 | R8.2 143.83,113.35 | 24.13,35.56 U$2.3 | R3.2 91.12,26.25 | 91.12,26.25 CON1.13 | 91.12,26.25 90.49,26.25 | 90.49,26.25 CON1.38 | R10.1 24.13,35.56 | 24.13,35.56 24.13,32.7 25.08,31.75 32.07,31.75 33.34,33.02 U$2.15 v55.88,33.02 | 90.49,26.25 C19.1 | C19.1 | R12.2 v152.4,95.89 | C16.1 140.02,25.08 | R9.1 93.03,114.62 93.34,114.94 | C9.1 51.75,114.94 | C31.1 49.85,53.98 49.53,54.3
  Bottom 0.61: v113.03,89.53 U$1.31 C1.1 | U$5.24 139.06,92.08 | 139.06,92.08 v151.76,92.08 152.4,92.71 v152.4,95.89 | J1.5 151.76,107.47 v152.4,104.78 | R19.2 69.22,114.94 | C12.1 72.39,114.94 | C14.1 IC5.14 | C15.1 139.06,92.08 | R2.1 v91.12,92.08 | C24.+ 73.34,36.83 | IC4.16 149.54,23.5 148.06,24.98 C16.1 117.89,24.98 116.84,26.04 101.6,26.04 100.11,27.52 R6.2 | C26.1 IC11.20 57.47,5.08 56.83,5.71 56.83,17.46 58.1,18.73 v58.74,18.73 60.32,18.73 R16.2 | v58.74,36.83 v55.88,36.83 | D2.A 61.75,36.98 61.59,36.83 | C19.1 v90.49,29.21 | v65.72,76.83 v67.31,76.83 IC3.26 | IC3.25 v67.31,74.3 v65.72,74.3 | R11.1 QG1.14 C3.1 | C6.2 IC7.16 C10.1 | C29.2 IC6.16 C2.1 | v67.31,55.88 57.78,55.88 56.2,54.29 R13.2 49.53,54.3 IC8.5
  Bottom 0.813: IC3.40 72.39,114.94 | R17.2 78.11,114.94 | IC2.40 51.75,114.94 | v58.74,36.83 61.59,36.83 v71.12,36.83 73.34,36.83 R5.2 R4.2 94.61,36.83 98.11,33.34 v98.11,29.21 R6.2 | C17.1 IC1.28 74.3,55.88 v71.12,55.88 v67.31,55.88 | v4.45,71.75 17.14,71.75 17.78,71.12 IC6.16
  Bottom 1.016: 143.51,113.67 R7.2 133.99,114.94 v113.03,114.94 IC5.14 93.34,114.94 v91.12,114.94 89.22,116.84 85.72,116.84 83.82,114.94 C21.+ 78.11,114.94 72.39,114.94 69.22,114.94 v67.31,114.94 51.75,114.94 33.66,114.94 32.07,113.35 32.07,111.12 | 143.51,113.67 148.59,113.67 151.69,110.57 J1.5 | 143.83,113.35 143.51,113.67 | QG1.14 32.07,111.12 | IC7.16 17.78,107.31 | v4.45,107.31 X3.1 17.78,107.31 | 32.07,111.12 19.04,111.12 17.78,109.86 17.78,107.31
VPA
  Bottom 0.406: C13.2 | C18.+
  Bottom 0.61: C18.+ C13.2 D1.C U$2.18 | C18.+ 55.89,43.17 D2.C
WR  (via drill 0.6 pad 1.42)
  Top 0.406: v107.31,47.94 v107.31,104.78
  Bottom 0.406: SV2.40 156.84,46.35 154.94,46.35 149.22,40.64 130.18,40.64 122.87,47.94 v107.31,47.94 | v107.31,104.78 U$1.4
XTAL1
  Bottom 0.61: IC3.2 60.33,109.86 | 60.33,109.86 C22.2 | X4.1 60.3,109.83 60.33,109.86
XTAL2
  Bottom 0.61: IC3.3 60.33,107.31 | 60.33,107.31 C27.2 | X4.2 60.3,107.33 60.33,107.31